# EAGLE schematic mainboard_r15_eurobot2014_r1 (EAGLE 6.3)

## Sheet 1 of 9
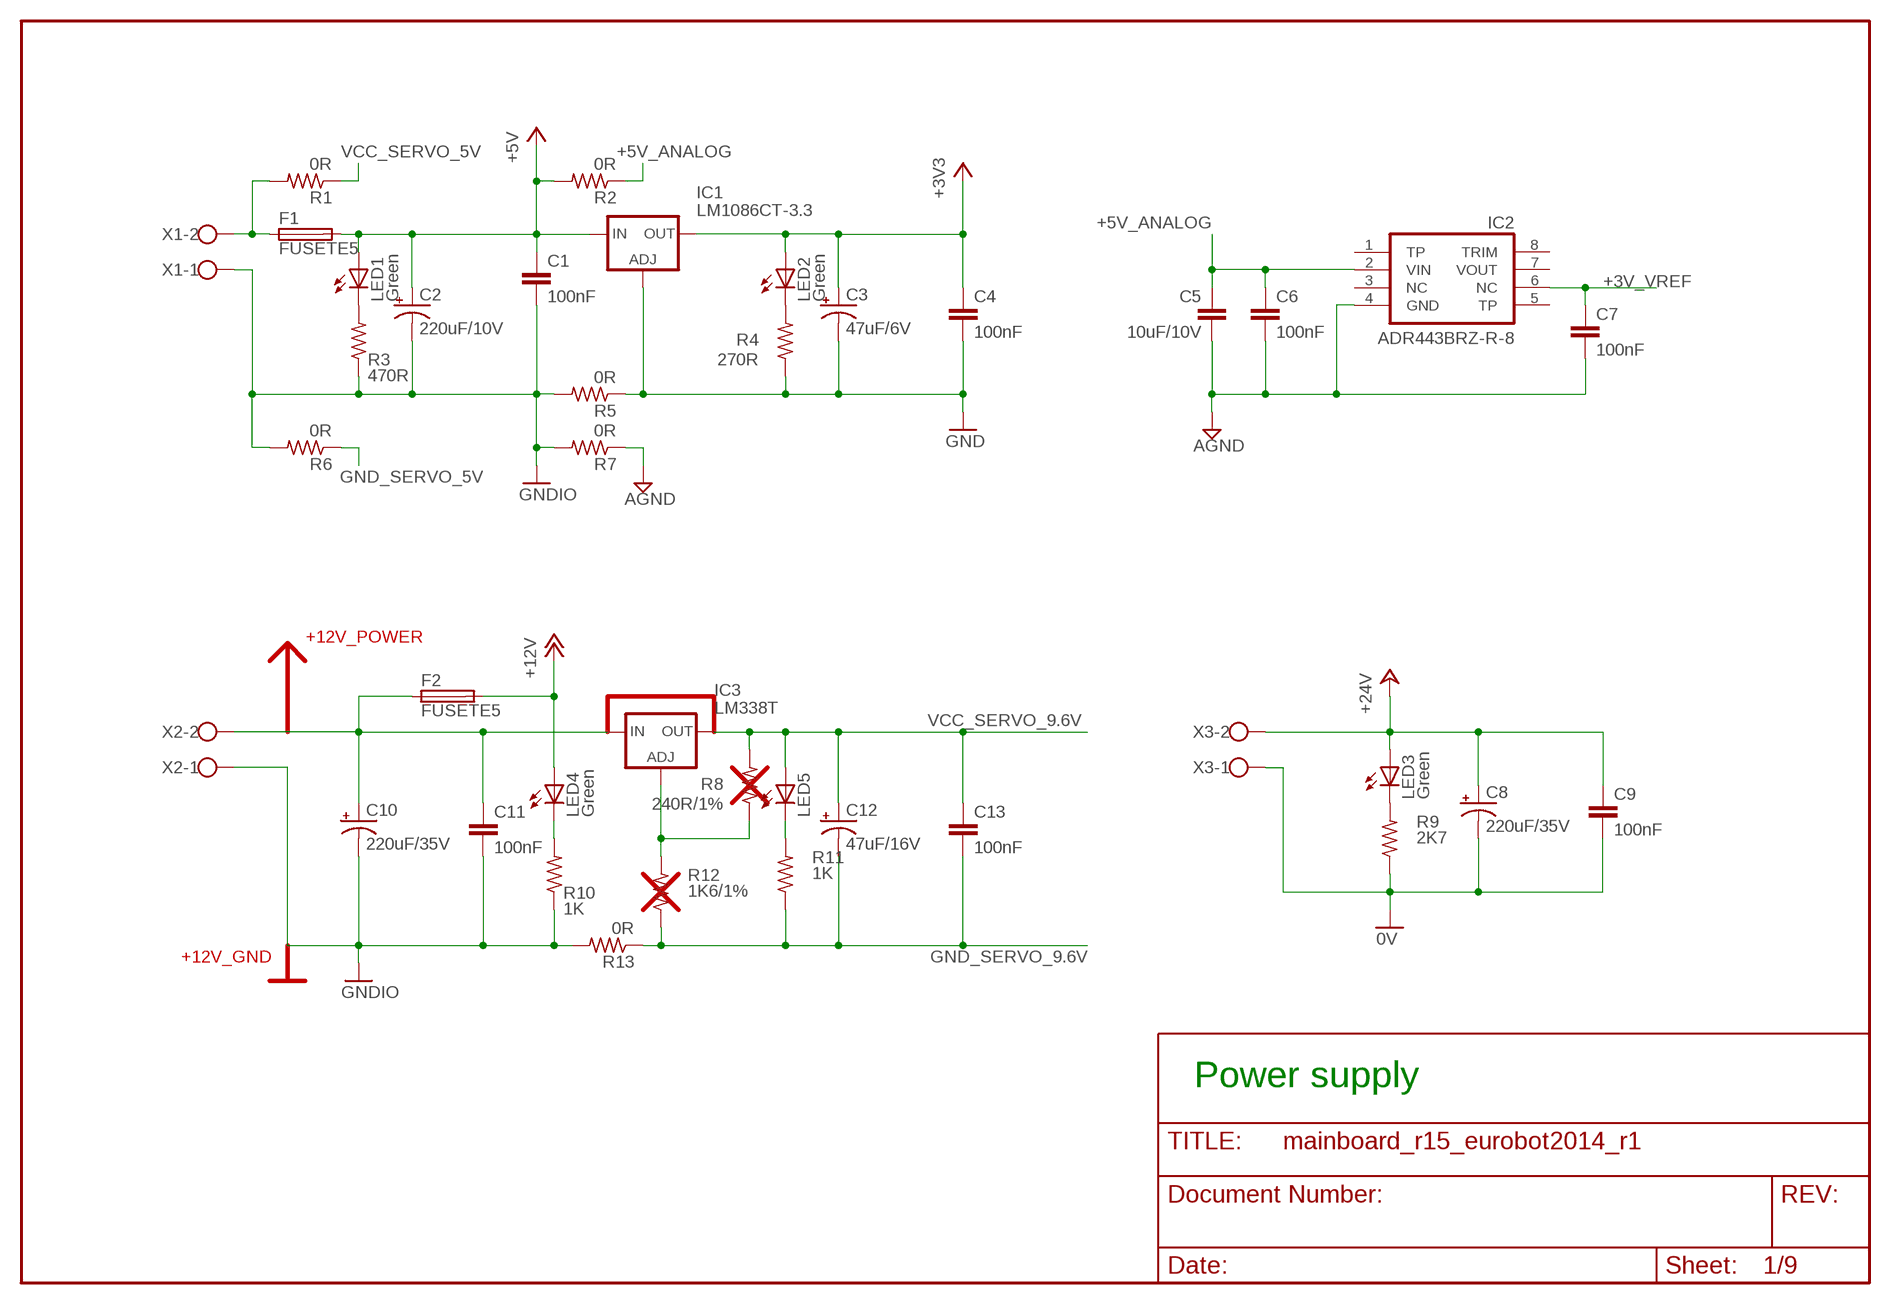
[diagram p0: schematic, sheet 1]

### Parts
C1  100nF  C-EUC0805  [C0805]
C2  220uF/10V  CPOL-USE2.5-7  [E2,5-7]
C3  47uF/6V  CPOL-USSMCD  [SMC_D]
C4  100nF  C-EUC0805  [C0805]
C5  10uF/10V  C-EUC1206  [C1206]
C6  100nF  C-EUC0805  [C0805]
C7  100nF  C-EUC0805  [C0805]
C8  220uF/35V  CPOL-USE5-10.5  [E5-10,5]
C9  100nF  C-EUC0805  [C0805]
C10  220uF/35V  CPOL-USE5-10.5  [E5-10,5]
C11  100nF  C-EUC0805  [C0805]
C12  47uF/16V  CPOL-USSMCD  [SMC_D]
C13  100nF  C-EUC0805  [C0805]
F1  FUSETE5  [TE5]
F2  FUSETE5  [TE5]
IC1  LM1086CT-3.3  LM317TS  [317TS]
IC2  ADR443BRZ-R-8  ADR443  [SOIC8]
IC3  LM338T  LM317TS  [317TS]
LED1  Green  LEDCHIP-LED0805  [CHIP-LED0805]
LED2  Green  LEDCHIP-LED0805  [CHIP-LED0805]
LED3  Green  LEDCHIP-LED0805  [CHIP-LED0805]
LED4  Green  LEDCHIP-LED0805  [CHIP-LED0805]
LED5  LEDCHIP-LED0805  [CHIP-LED0805]
R1  0R  R-US_R0805  [R0805]
R2  0R  R-US_R0805  [R0805]
R3  470R  R-US_R0805  [R0805]
R4  270R  R-US_R0805  [R0805]
R5  0R  R-US_R0805  [R0805]
R6  0R  R-US_R0805  [R0805]
R7  0R  R-US_R0805  [R0805]
R8  240R/1%  R-US_R0805  [R0805]
R9  2K7  R-US_R0805  [R0805]
R10  1K  R-US_R0805  [R0805]
R11  1K  R-US_R0805  [R0805]
R12  1K6/1%  R-US_R0805  [R0805]
R13  0R  R-US_R0805  [R0805]
X1  W237-02P  [W237-132]
X2  W237-02P  [W237-132]
X3  W237-02P  [W237-132]

### Nets
0V: C8.- C9.2 R9.1 X3.1 ; also sheet 7,8
+3V3: C3.+ C4.1 IC1.2(OUT) LED2.A ; also sheet 2,3,9
+3V_VREF: C7.1 IC2.6(NC) ; also sheet 2,3,4,8
+5V: C1.1 C2.+ F1.2 IC1.3(IN) LED1.A R2.2 ; also sheet 2,4,5,6,7
+5V_ANALOG: C5.1 C6.1 IC2.2(VIN) R2.1 ; also sheet 4,8
+12V: F2.2 LED4.A ; also sheet 4,5
+24V: C8.+ C9.1 LED3.A X3.2 ; also sheet 7,8
AGND: C5.2 C6.2 C7.2 IC2.4(GND) R7.1 ; also sheet 2,3,4,8
GND: C3.- C4.2 IC1.1(ADJ) R4.1 R5.1 ; also sheet 2,3,5,8,9
GND_SERVO_5V: R6.1 ; also sheet 6
GND_SERVO_9.6V: C12.- C13.2 R11.1 R12.1 R13.1 ; also sheet 6
GNDIO: C1.2 C2.- C10.- C11.2 R3.1 R5.2 R6.2 R7.2 R10.1 R13.2 X1.1 X2.1 ; also sheet 4,5,7
N$3: IC3.1(ADJ) R8.1 R12.2
N$12: LED5.C R11.2
N$43: C10.+ C11.1 F2.1 IC3.3(IN) X2.2
N$64: LED1.C R3.2
N$65: LED2.C R4.2
N$66: LED4.C R10.2
N$67: LED3.C R9.2
N$112: F1.1 R1.2 X1.2
VCC_SERVO_5V: R1.1 ; also sheet 6
VCC_SERVO_9.6V: C12.+ C13.1 IC3.2(OUT) LED5.A R8.2 ; also sheet 6
Unconnected: IC2.1(TP) IC2.3(NC) IC2.5(TP) IC2.7(VOUT) IC2.8(TRIM)

### Notes on the sheet
- +12V_POWER
- +12V_GND
- Power supply

## Sheet 2 of 9
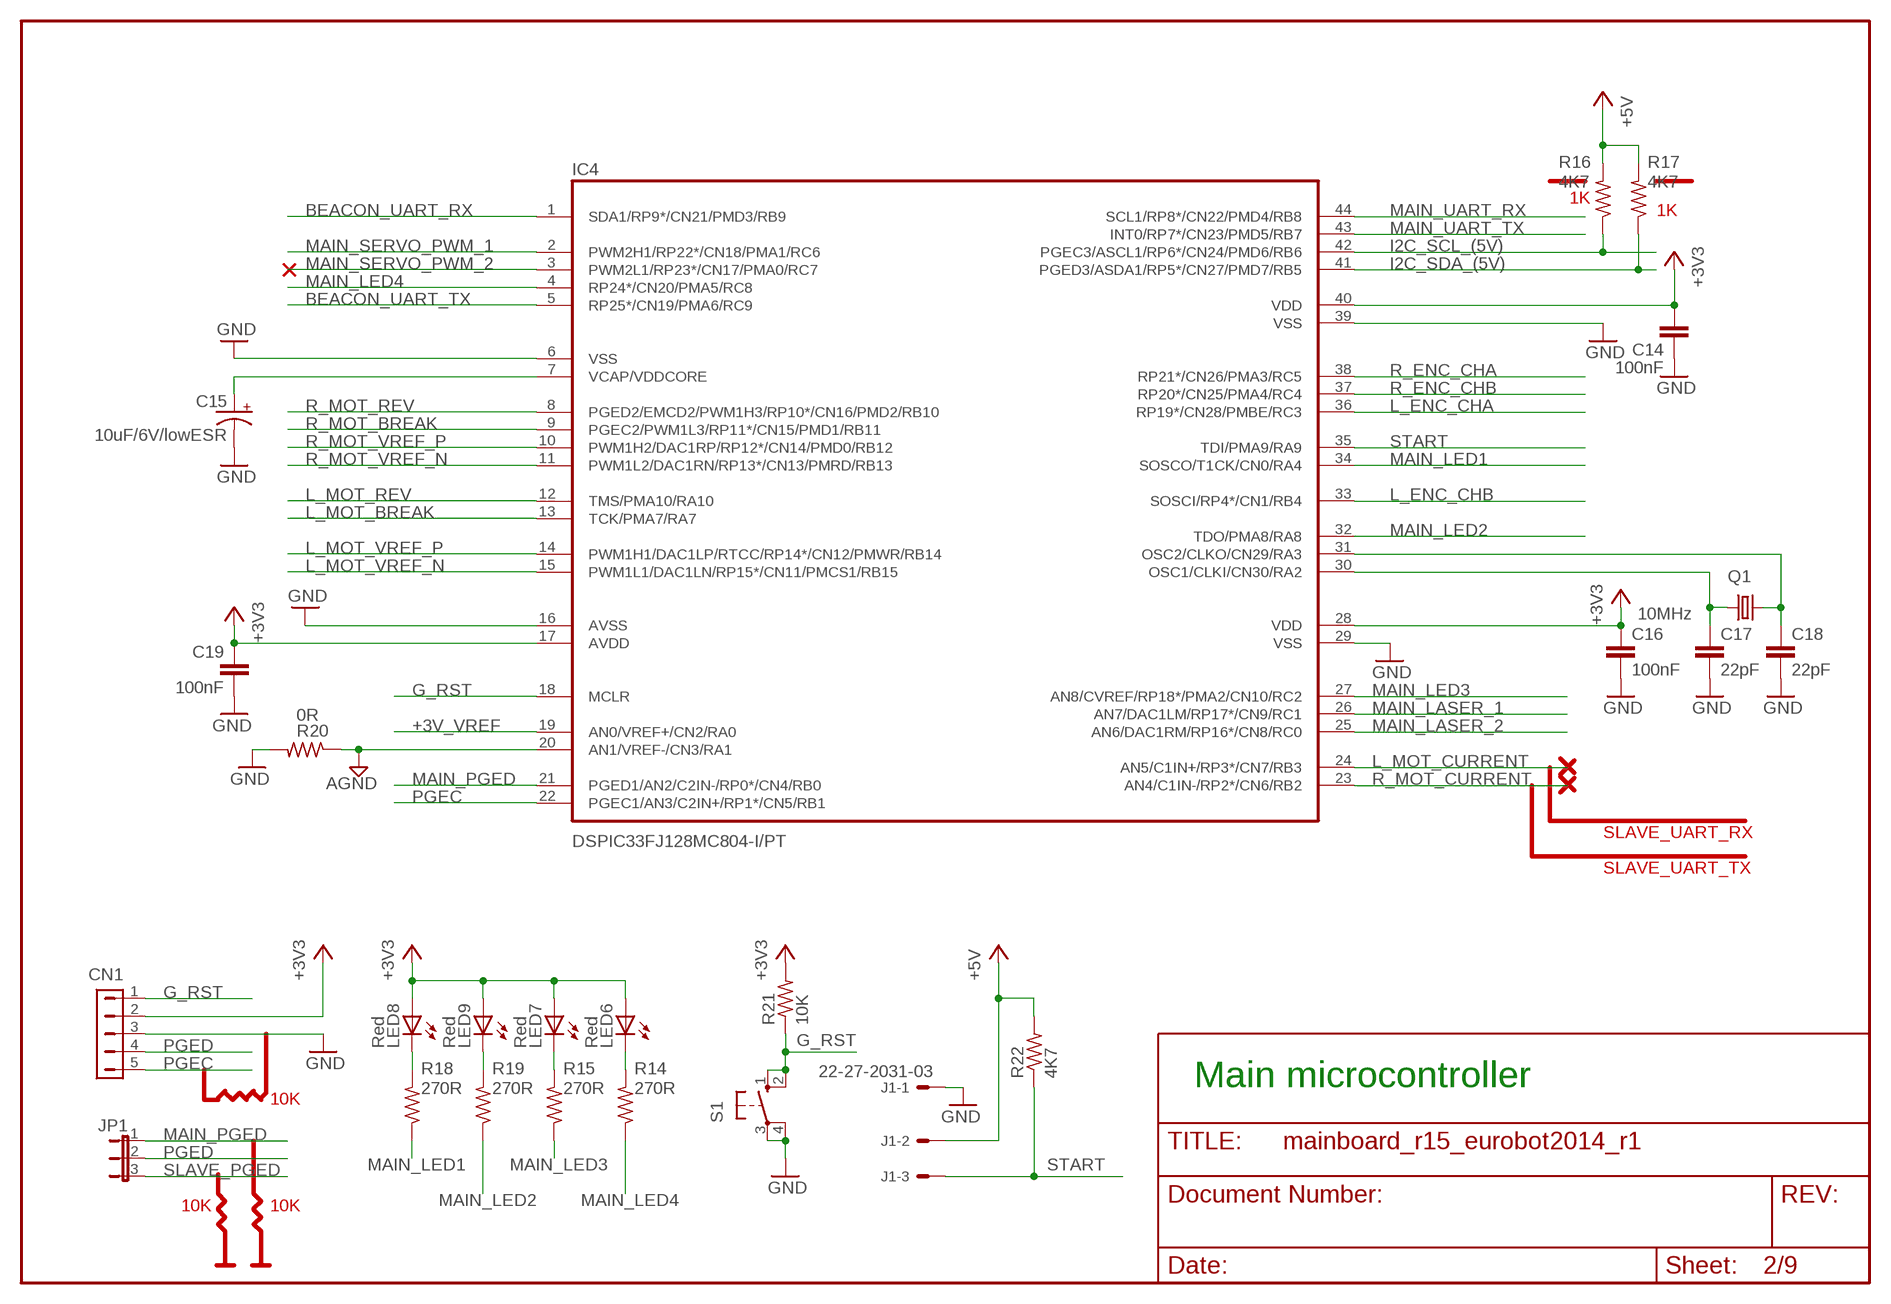
[diagram p1: schematic, sheet 2]

### Parts
C14  100nF  C-EUC0603  [C0603]
C15  10uF/6V/lowESR  CPOL-USSMCA  [SMC_A]
C16  100nF  C-EUC0603  [C0603]
C17  22pF  C-EUC0805  [C0805]
C18  22pF  C-EUC0805  [C0805]
C19  100nF  C-EUC0603  [C0603]
CN1  HDR-1X5-SIP-100  [SIP-100-5V]
IC4  DSPIC33FJ128MC804-I/PT  DSPIC33FJXXMC804SMD  [TQFP44]
J1  22-27-2031-03  [6410-03]
JP1  JP2E  [JP2]
LED6  Red  LEDCHIP-LED0805  [CHIP-LED0805]
LED7  Red  LEDCHIP-LED0805  [CHIP-LED0805]
LED8  Red  LEDCHIP-LED0805  [CHIP-LED0805]
LED9  Red  LEDCHIP-LED0805  [CHIP-LED0805]
Q1  10MHz  CRYSTALHC49UP  [HC49UP]
R14  270R  R-US_R0805  [R0805]
R15  270R  R-US_R0805  [R0805]
R16  4K7  R-US_R0805  [R0805]
R17  4K7  R-US_R0805  [R0805]
R18  270R  R-US_R0805  [R0805]
R19  270R  R-US_R0805  [R0805]
R20  0R  R-US_R0805  [R0805]
R21  10K  R-US_R0805  [R0805]
R22  4K7  R-US_R0805  [R0805]
S1  10-XX  [B3F-10XX]

### Nets
+3V3: C14.1 C16.1 C19.1 CN1.2 IC4.17(AVDD) IC4.28(VDD) IC4.40(VDD) LED6.A LED7.A LED8.A LED9.A R21.2 ; also sheet 1,3,9
+3V_VREF: IC4.19(AN0/VREF+/CN2/RA0) ; also sheet 1,3,4,8
+5V: J1.2 R16.2 R17.2 R22.2 ; also sheet 1,4,5,6,7
AGND: IC4.20(AN1/VREF-/CN3/RA1) R20.1 ; also sheet 1,3,4,8
BEACON_UART_RX: IC4.1(SDA1/RP9*/CN21/PMD3/RB9) ; also sheet 9
BEACON_UART_TX: IC4.5(RP25*/CN19/PMA6/RC9) ; also sheet 9
G_RST: CN1.1 IC4.18(MCLR) R21.1 S1.1(S) S1.2(S1) ; also sheet 3
GND: C14.2 C15.- C16.2 C17.2 C18.2 C19.2 CN1.3 IC4.6(VSS) IC4.16(AVSS) IC4.29(VSS) IC4.39(VSS) J1.1 R20.2 S1.3(P) S1.4(P1) ; also sheet 1,3,5,8,9
I2C_SCL_(5V): IC4.42(PGEC3/ASCL1/RP6*/CN24/PMD6/RB6) R16.1 ; also sheet 3,5
I2C_SDA_(5V): IC4.41(PGED3/ASDA1/RP5*/CN27/PMD7/RB5) R17.1 ; also sheet 3,5
L_ENC_CHA: IC4.36(RP19*/CN28/PMBE/RC3) ; also sheet 5
L_ENC_CHB: IC4.33(SOSCI/RP4*/CN1/RB4) ; also sheet 5
L_MOT_BREAK: IC4.13(TCK/PMA7/RA7) ; also sheet 8
L_MOT_CURRENT: IC4.24(AN5/C1IN+/RP3*/CN7/RB3) ; also sheet 8
L_MOT_REV: IC4.12(TMS/PMA10/RA10) ; also sheet 8
L_MOT_VREF_N: IC4.15(PWM1L1/DAC1LN/RP15*/CN11/PMCS1/RB15) ; also sheet 8
L_MOT_VREF_P: IC4.14(PWM1H1/DAC1LP/RTCC/RP14*/CN12/PMWR/RB14) ; also sheet 8
MAIN_LASER_1: IC4.26(AN7/DAC1LM/RP17*/CN9/RC1) ; also sheet 4
MAIN_LASER_2: IC4.25(AN6/DAC1RM/RP16*/CN8/RC0) ; also sheet 4
MAIN_LED1: IC4.34(SOSCO/T1CK/CN0/RA4) R18.1
MAIN_LED2: IC4.32(TDO/PMA8/RA8) R19.1
MAIN_LED3: IC4.27(AN8/CVREF/RP18*/PMA2/CN10/RC2) R15.1
MAIN_LED4: IC4.4(RP24*/CN20/PMA5/RC8) R14.1
MAIN_PGED: IC4.21(PGED1/AN2/C2IN-/RP0*/CN4/RB0) JP1.1
MAIN_SERVO_PWM_1: IC4.2(PWM2H1/RP22*/CN18/PMA1/RC6) ; also sheet 6
MAIN_SERVO_PWM_2: IC4.3(PWM2L1/RP23*/CN17/PMA0/RC7) ; also sheet 6
MAIN_UART_RX: IC4.44(SCL1/RP8*/CN22/PMD4/RB8) ; also sheet 9
MAIN_UART_TX: IC4.43(INT0/RP7*/CN23/PMD5/RB7) ; also sheet 9
N$8: LED8.C R18.2
N$10: LED9.C R19.2
N$11: LED7.C R15.2
N$13: LED6.C R14.2
N$47: C18.1 IC4.31(OSC2/CLKO/CN29/RA3) Q1.2
N$48: C17.1 IC4.30(OSC1/CLKI/CN30/RA2) Q1.1
N$49: C15.+ IC4.7(VCAP/VDDCORE)
PGEC: CN1.5 IC4.22(PGEC1/AN3/C2IN+/RP1*/CN5/RB1) ; also sheet 3
PGED: CN1.4 JP1.2
R_ENC_CHA: IC4.38(RP21*/CN26/PMA3/RC5) ; also sheet 5
R_ENC_CHB: IC4.37(RP20*/CN25/PMA4/RC4) ; also sheet 5
R_MOT_BREAK: IC4.9(PGEC2/PWM1L3/RP11*/CN15/PMD1/RB11) ; also sheet 8
R_MOT_CURRENT: IC4.23(AN4/C1IN-/RP2*/CN6/RB2) ; also sheet 8
R_MOT_REV: IC4.8(PGED2/EMCD2/PWM1H3/RP10*/CN16/PMD2/RB10) ; also sheet 8
R_MOT_VREF_N: IC4.11(PWM1L2/DAC1RN/RP13*/CN13/PMRD/RB13) ; also sheet 8
R_MOT_VREF_P: IC4.10(PWM1H2/DAC1RP/RP12*/CN14/PMD0/RB12) ; also sheet 8
SLAVE_PGED: JP1.3 ; also sheet 3
START: IC4.35(TDI/PMA9/RA9) J1.3 R22.1

### Notes on the sheet
- 1K
- 1K
- SLAVE_UART_RX
- SLAVE_UART_TX
- Main microcontroller
- 10K
- 10K | 10K

## Sheet 3 of 9
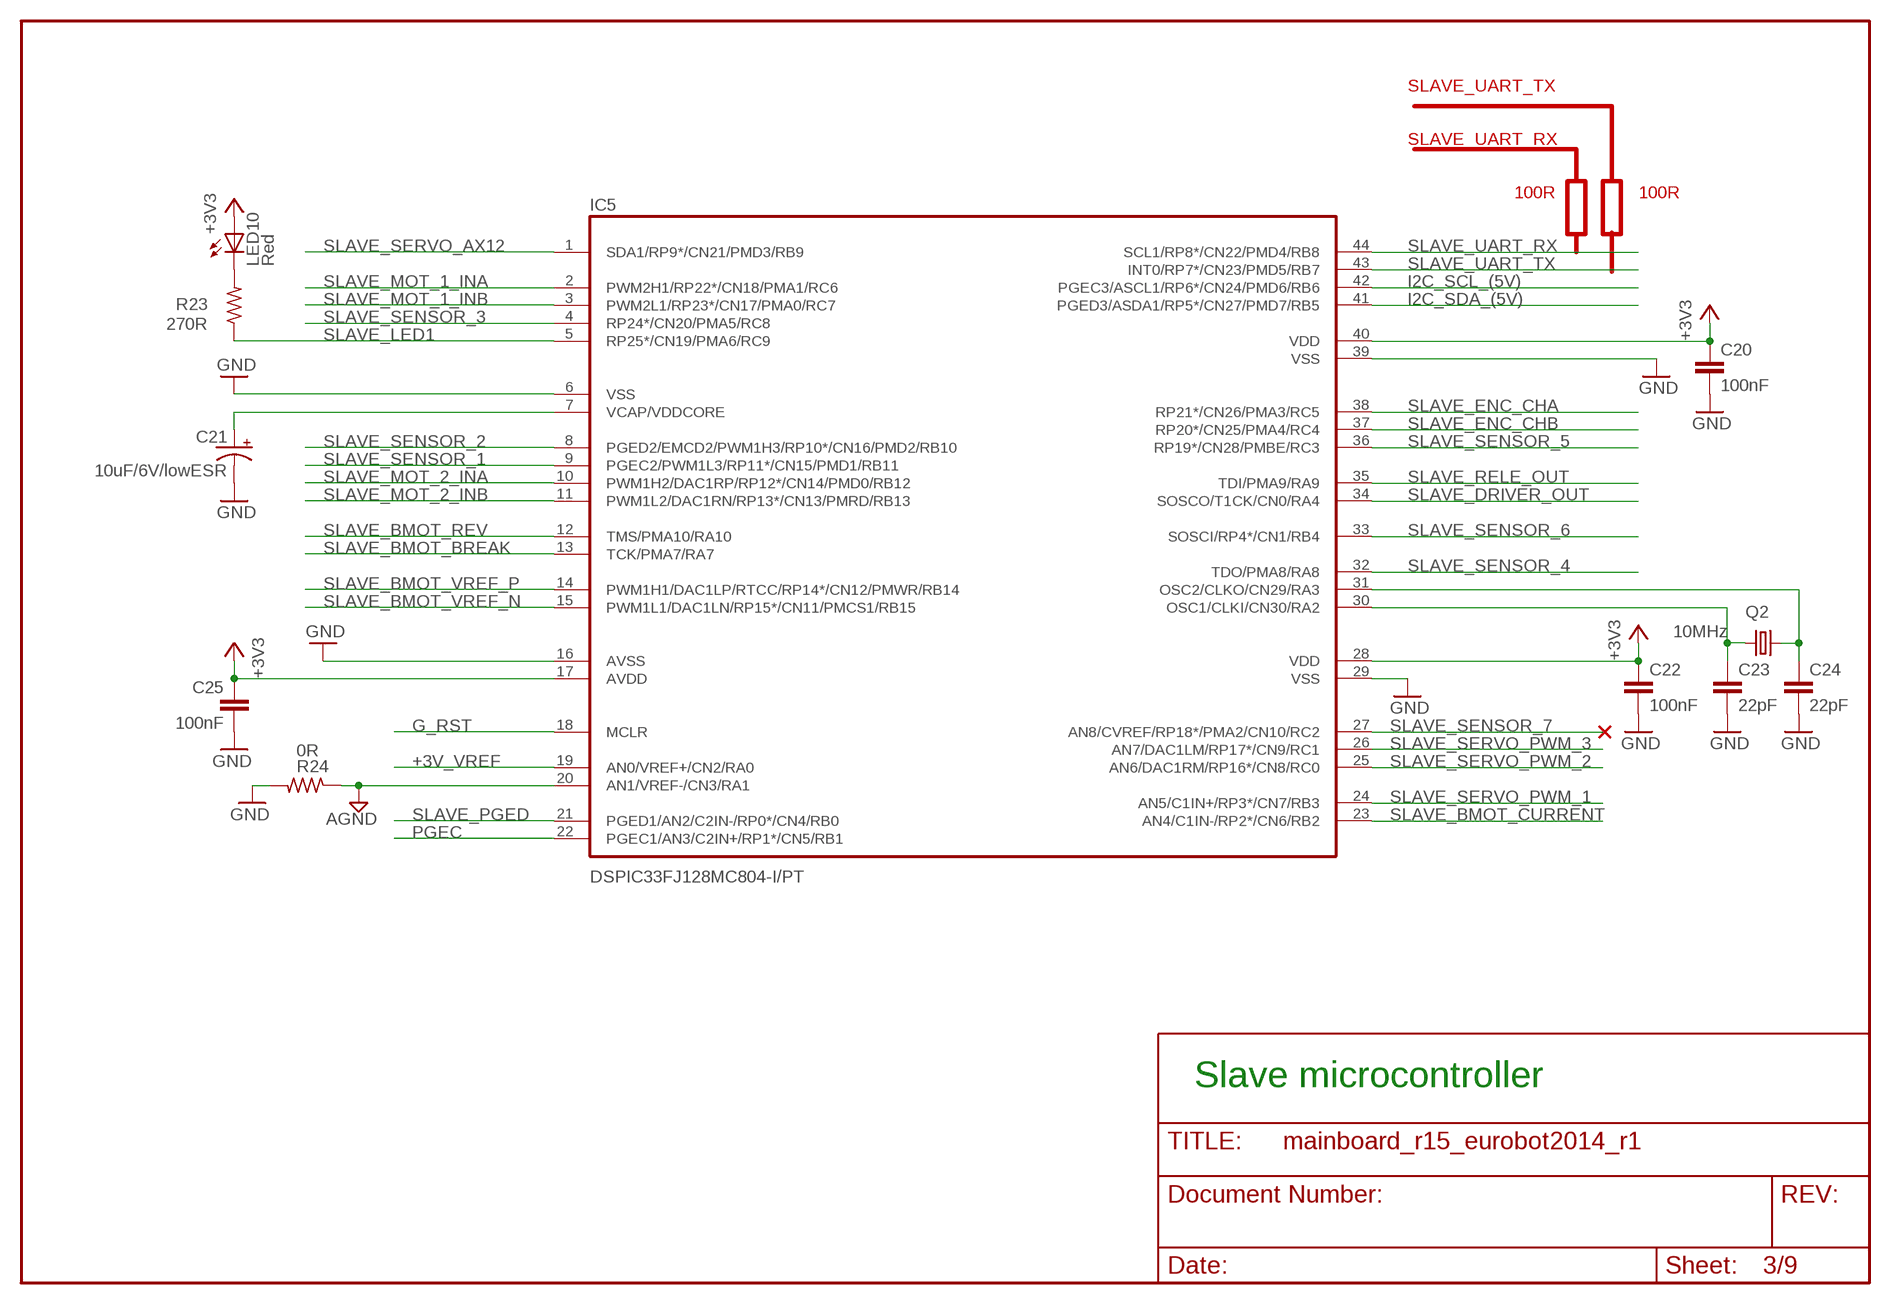
[diagram p2: schematic, sheet 3]

### Parts
C20  100nF  C-EUC0603  [C0603]
C21  10uF/6V/lowESR  CPOL-USSMCA  [SMC_A]
C22  100nF  C-EUC0603  [C0603]
C23  22pF  C-EUC0805  [C0805]
C24  22pF  C-EUC0805  [C0805]
C25  100nF  C-EUC0603  [C0603]
IC5  DSPIC33FJ128MC804-I/PT  DSPIC33FJXXMC804SMD  [TQFP44]
LED10  Red  LEDCHIP-LED0805  [CHIP-LED0805]
Q2  10MHz  CRYSTALHC49UP  [HC49UP]
R23  270R  R-US_R0805  [R0805]
R24  0R  R-US_R0805  [R0805]

### Nets
+3V3: C20.1 C22.1 C25.1 IC5.17(AVDD) IC5.28(VDD) IC5.40(VDD) LED10.A ; also sheet 1,2,9
+3V_VREF: IC5.19(AN0/VREF+/CN2/RA0) ; also sheet 1,2,4,8
AGND: IC5.20(AN1/VREF-/CN3/RA1) R24.1 ; also sheet 1,2,4,8
G_RST: IC5.18(MCLR) ; also sheet 2
GND: C20.2 C21.- C22.2 C23.2 C24.2 C25.2 IC5.6(VSS) IC5.16(AVSS) IC5.29(VSS) IC5.39(VSS) R24.2 ; also sheet 1,2,5,8,9
I2C_SCL_(5V): IC5.42(PGEC3/ASCL1/RP6*/CN24/PMD6/RB6) ; also sheet 2,5
I2C_SDA_(5V): IC5.41(PGED3/ASDA1/RP5*/CN27/PMD7/RB5) ; also sheet 2,5
N$1: LED10.C R23.2
N$50: C24.1 IC5.31(OSC2/CLKO/CN29/RA3) Q2.2
N$51: C23.1 IC5.30(OSC1/CLKI/CN30/RA2) Q2.1
N$52: C21.+ IC5.7(VCAP/VDDCORE)
PGEC: IC5.22(PGEC1/AN3/C2IN+/RP1*/CN5/RB1) ; also sheet 2
SLAVE_BMOT_BREAK: IC5.13(TCK/PMA7/RA7) ; also sheet 8
SLAVE_BMOT_CURRENT: IC5.23(AN4/C1IN-/RP2*/CN6/RB2) ; also sheet 8
SLAVE_BMOT_REV: IC5.12(TMS/PMA10/RA10) ; also sheet 8
SLAVE_BMOT_VREF_N: IC5.15(PWM1L1/DAC1LN/RP15*/CN11/PMCS1/RB15) ; also sheet 8
SLAVE_BMOT_VREF_P: IC5.14(PWM1H1/DAC1LP/RTCC/RP14*/CN12/PMWR/RB14) ; also sheet 8
SLAVE_DRIVER_OUT: IC5.34(SOSCO/T1CK/CN0/RA4) ; also sheet 7
SLAVE_ENC_CHA: IC5.38(RP21*/CN26/PMA3/RC5) ; also sheet 5
SLAVE_ENC_CHB: IC5.37(RP20*/CN25/PMA4/RC4) ; also sheet 5
SLAVE_LED1: IC5.5(RP25*/CN19/PMA6/RC9) R23.1
SLAVE_MOT_1_INA: IC5.2(PWM2H1/RP22*/CN18/PMA1/RC6) ; also sheet 7
SLAVE_MOT_1_INB: IC5.3(PWM2L1/RP23*/CN17/PMA0/RC7) ; also sheet 7
SLAVE_MOT_2_INA: IC5.10(PWM1H2/DAC1RP/RP12*/CN14/PMD0/RB12) ; also sheet 7
SLAVE_MOT_2_INB: IC5.11(PWM1L2/DAC1RN/RP13*/CN13/PMRD/RB13) ; also sheet 7
SLAVE_PGED: IC5.21(PGED1/AN2/C2IN-/RP0*/CN4/RB0) ; also sheet 2
SLAVE_RELE_OUT: IC5.35(TDI/PMA9/RA9) ; also sheet 7
SLAVE_SENSOR_1: IC5.9(PGEC2/PWM1L3/RP11*/CN15/PMD1/RB11) ; also sheet 5
SLAVE_SENSOR_2: IC5.8(PGED2/EMCD2/PWM1H3/RP10*/CN16/PMD2/RB10) ; also sheet 5
SLAVE_SENSOR_3: IC5.4(RP24*/CN20/PMA5/RC8) ; also sheet 5
SLAVE_SENSOR_4: IC5.32(TDO/PMA8/RA8) ; also sheet 5
SLAVE_SENSOR_5: IC5.36(RP19*/CN28/PMBE/RC3) ; also sheet 5
SLAVE_SENSOR_6: IC5.33(SOSCI/RP4*/CN1/RB4) ; also sheet 5
SLAVE_SENSOR_7: IC5.27(AN8/CVREF/RP18*/PMA2/CN10/RC2) ; also sheet 5
SLAVE_SERVO_AX12: IC5.1(SDA1/RP9*/CN21/PMD3/RB9) ; also sheet 6
SLAVE_SERVO_PWM_1: IC5.24(AN5/C1IN+/RP3*/CN7/RB3) ; also sheet 6
SLAVE_SERVO_PWM_2: IC5.25(AN6/DAC1RM/RP16*/CN8/RC0) ; also sheet 6
SLAVE_SERVO_PWM_3: IC5.26(AN7/DAC1LM/RP17*/CN9/RC1) ; also sheet 6
SLAVE_UART_RX: IC5.44(SCL1/RP8*/CN22/PMD4/RB8) ; also sheet 9
SLAVE_UART_TX: IC5.43(INT0/RP7*/CN23/PMD5/RB7) ; also sheet 9

### Notes on the sheet
- SLAVE_UART_TX
- SLAVE_UART_RX
- 100R | 100R
- Slave microcontroller

## Sheet 4 of 9
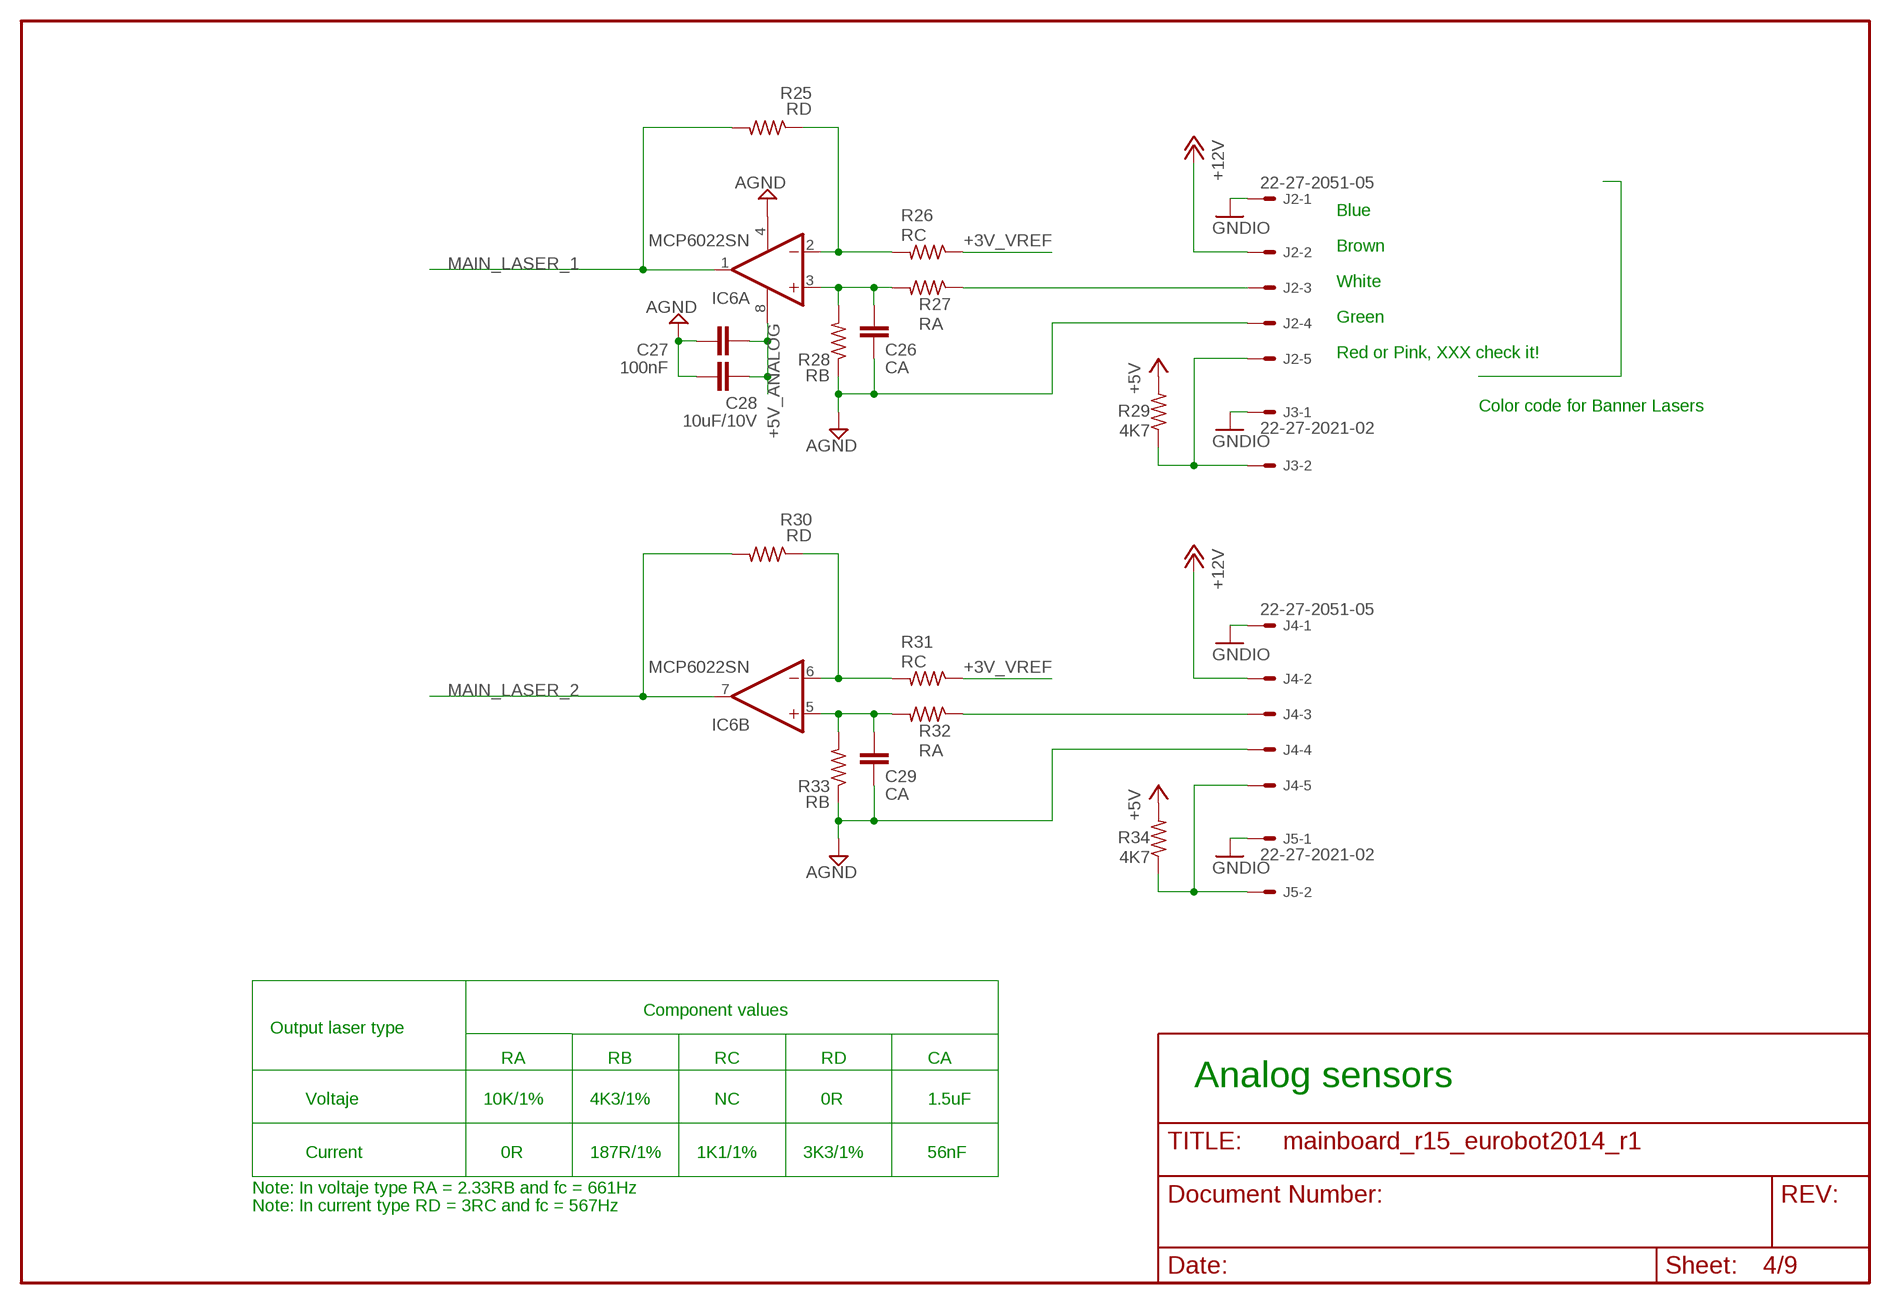
[diagram p3: schematic, sheet 4]

### Parts
C26  CA  C-EUC0805  [C0805]
C27  100nF  C-EUC0805  [C0805]
C28  10uF/10V  C-EUC1206  [C1206]
C29  CA  C-EUC0805  [C0805]
IC6  MCP6022SN  OPA2344U  [SO08]
J2  22-27-2051-05  [6410-05]
J3  22-27-2021-02  [6410-02]
J4  22-27-2051-05  [6410-05]
J5  22-27-2021-02  [6410-02]
R25  RD  R-US_R0805  [R0805]
R26  RC  R-US_R0805  [R0805]
R27  RA  R-US_R0805  [R0805]
R28  RB  R-US_R0805  [R0805]
R29  4K7  R-US_R0805  [R0805]
R30  RD  R-US_R0805  [R0805]
R31  RC  R-US_R0805  [R0805]
R32  RA  R-US_R0805  [R0805]
R33  RB  R-US_R0805  [R0805]
R34  4K7  R-US_R0805  [R0805]

### Nets
+3V_VREF: R26.1 R31.1 ; also sheet 1,2,3,8
+5V: R29.2 R34.2 ; also sheet 1,2,5,6,7
+5V_ANALOG: C27.1 C28.2 IC6.8(A:V+) ; also sheet 1,8
+12V: J2.2 J4.2 ; also sheet 1,5
AGND: C26.2 C27.2 C28.1 C29.2 IC6.4(A:V-) J2.4 J4.4 R28.1 R33.1 ; also sheet 1,2,3,8
GNDIO: J2.1 J3.1 J4.1 J5.1 ; also sheet 1,5,7
MAIN_LASER_1: IC6.1(A:OUT) R25.2 ; also sheet 2
MAIN_LASER_2: IC6.7(B:OUT) R30.2 ; also sheet 2
N$5: J2.3 R27.1
N$25: J4.5 J5.2 R34.1
N$28: J2.5 J3.2 R29.1
N$36: IC6.2(A:-IN) R25.1 R26.2
N$40: C26.1 IC6.3(A:+IN) R27.2 R28.2
N$94: IC6.6(B:-IN) R30.1 R31.2
N$95: C29.1 IC6.5(B:+IN) R32.2 R33.2
N$96: J4.3 R32.1

### Notes on the sheet
- Blue
- Brown
- White
- Green
- Red or Pink, XXX check it!
- Color code for Banner Lasers
- Component values
- Output laser type
- RA | RB | RC | RD | CA
- Analog sensors
- Voltaje | 10K/1% | 4K3/1% | NC | 0R | 1.5uF
- Current | 0R | 187R/1% | 1K1/1% | 3K3/1% | 56nF
- Note: In voltaje type RA = 2.33RB and fc = 661Hz
- Note: In current type RD = 3RC and fc = 567Hz

## Sheet 5 of 9
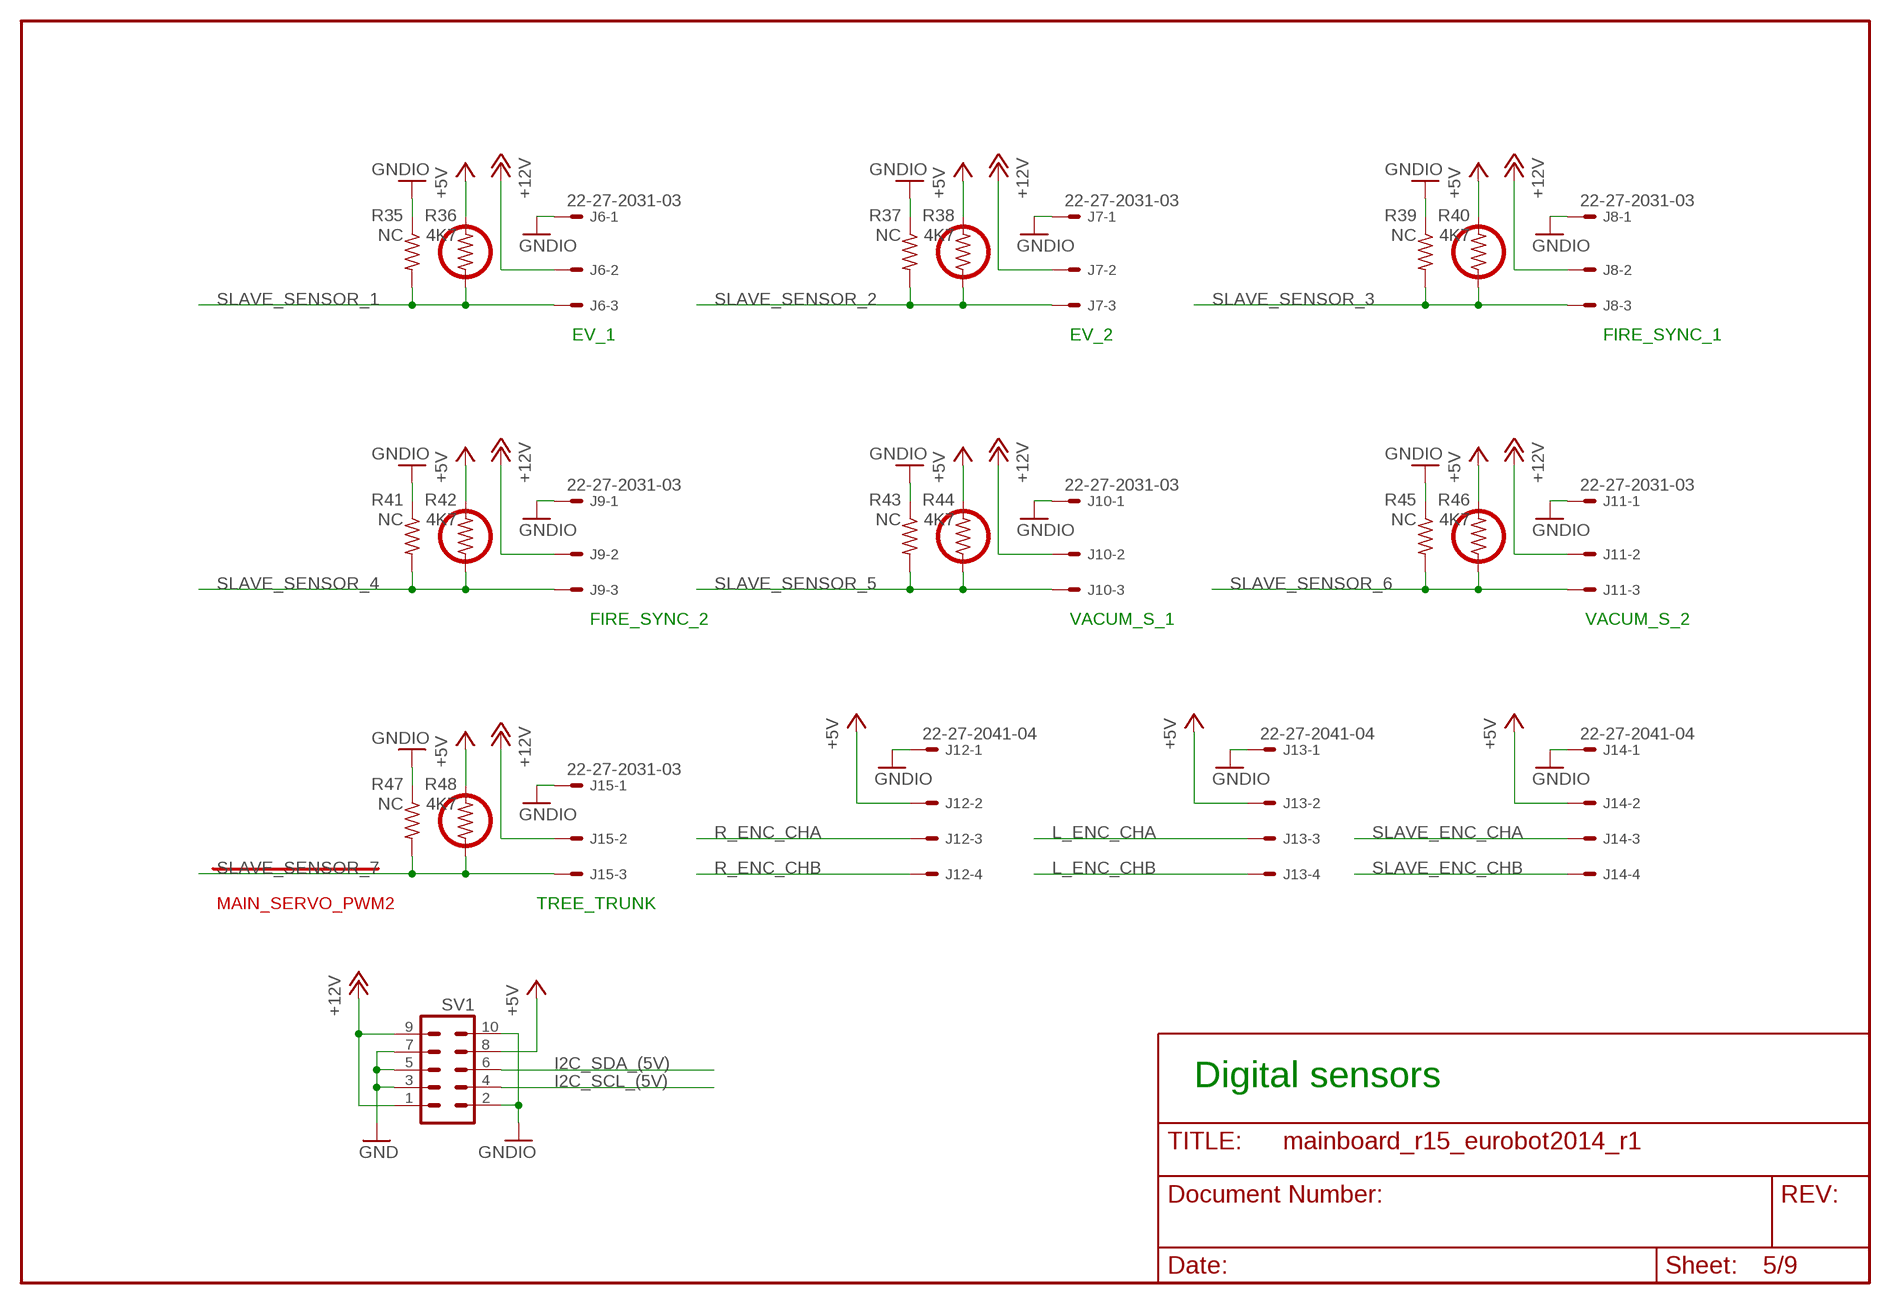
[diagram p4: schematic, sheet 5]

### Parts
J6  22-27-2031-03  [6410-03]
J7  22-27-2031-03  [6410-03]
J8  22-27-2031-03  [6410-03]
J9  22-27-2031-03  [6410-03]
J10  22-27-2031-03  [6410-03]
J11  22-27-2031-03  [6410-03]
J12  22-27-2041-04  [6410-04]
J13  22-27-2041-04  [6410-04]
J14  22-27-2041-04  [6410-04]
J15  22-27-2031-03  [6410-03]
R35  NC  R-US_R0805  [R0805]
R36  4K7  R-US_R0805  [R0805]
R37  NC  R-US_R0805  [R0805]
R38  4K7  R-US_R0805  [R0805]
R39  NC  R-US_R0805  [R0805]
R40  4K7  R-US_R0805  [R0805]
R41  NC  R-US_R0805  [R0805]
R42  4K7  R-US_R0805  [R0805]
R43  NC  R-US_R0805  [R0805]
R44  4K7  R-US_R0805  [R0805]
R45  NC  R-US_R0805  [R0805]
R46  4K7  R-US_R0805  [R0805]
R47  NC  R-US_R0805  [R0805]
R48  4K7  R-US_R0805  [R0805]
SV1  ML10  [ML10]

### Nets
+5V: J12.2 J13.2 J14.2 R36.2 R38.2 R40.2 R42.2 R44.2 R46.2 R48.2 SV1.8 ; also sheet 1,2,4,6,7
+12V: J6.2 J7.2 J8.2 J9.2 J10.2 J11.2 J15.2 SV1.1 SV1.9 ; also sheet 1,4
GND: SV1.3 SV1.5 SV1.7 ; also sheet 1,2,3,8,9
GNDIO: J6.1 J7.1 J8.1 J9.1 J10.1 J11.1 J12.1 J13.1 J14.1 J15.1 R35.1 R37.1 R39.1 R41.1 R43.1 R45.1 R47.1 SV1.2 SV1.10 ; also sheet 1,4,7
I2C_SCL_(5V): SV1.4 ; also sheet 2,3
I2C_SDA_(5V): SV1.6 ; also sheet 2,3
L_ENC_CHA: J13.3 ; also sheet 2
L_ENC_CHB: J13.4 ; also sheet 2
R_ENC_CHA: J12.3 ; also sheet 2
R_ENC_CHB: J12.4 ; also sheet 2
SLAVE_ENC_CHA: J14.3 ; also sheet 3
SLAVE_ENC_CHB: J14.4 ; also sheet 3
SLAVE_SENSOR_1: J6.3 R35.2 R36.1 ; also sheet 3
SLAVE_SENSOR_2: J7.3 R37.2 R38.1 ; also sheet 3
SLAVE_SENSOR_3: J8.3 R39.2 R40.1 ; also sheet 3
SLAVE_SENSOR_4: J9.3 R41.2 R42.1 ; also sheet 3
SLAVE_SENSOR_5: J10.3 R43.2 R44.1 ; also sheet 3
SLAVE_SENSOR_6: J11.3 R45.2 R46.1 ; also sheet 3
SLAVE_SENSOR_7: J15.3 R47.2 R48.1 ; also sheet 3

### Notes on the sheet
- EV_1 | EV_2 | FIRE_SYNC_1
- FIRE_SYNC_2 | VACUM_S_1 | VACUM_S_2
- MAIN_SERVO_PWM2 | TREE_TRUNK
- Digital sensors

## Sheet 6 of 9
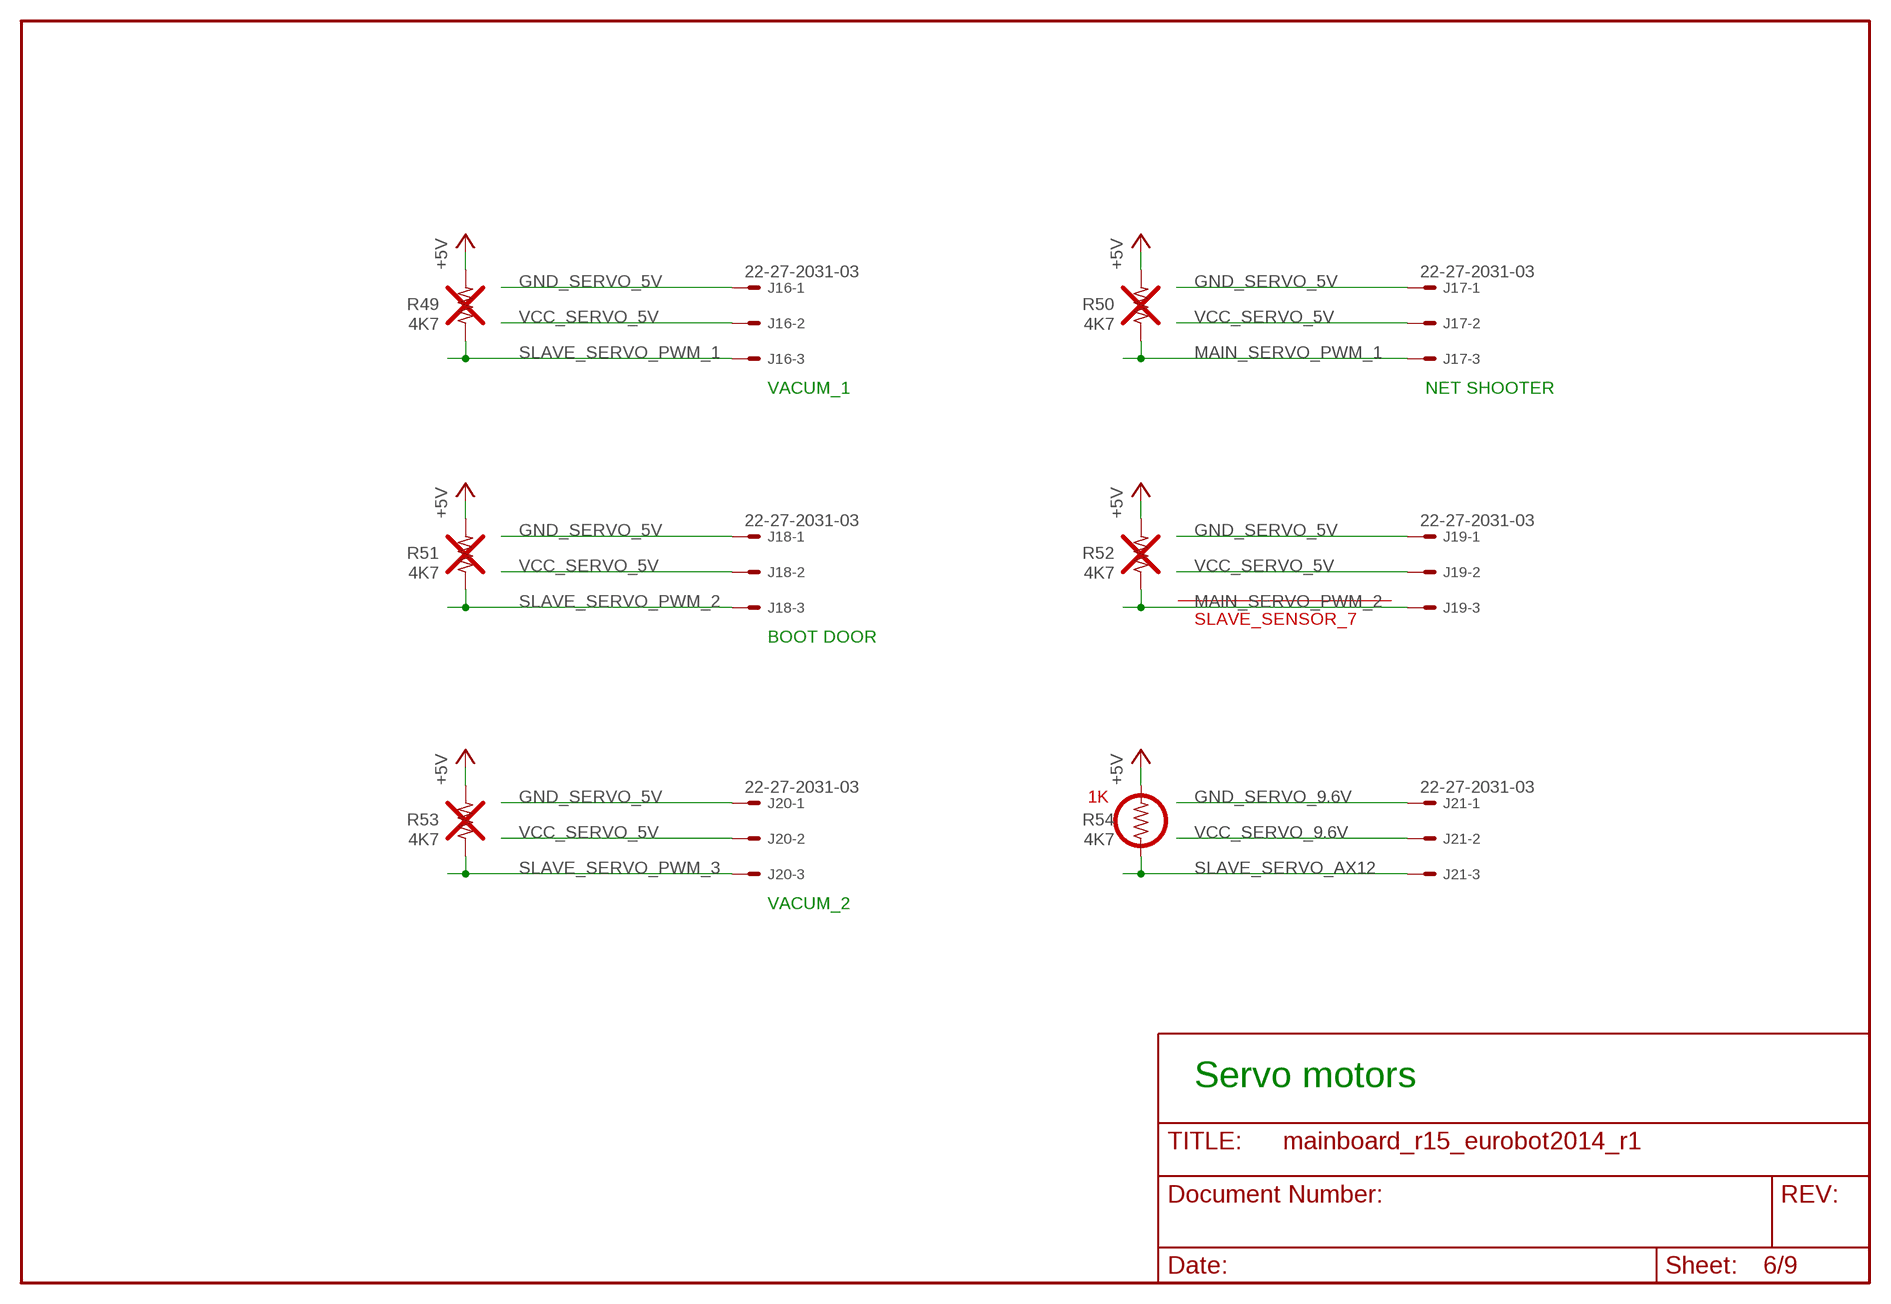
[diagram p5: schematic, sheet 6]

### Parts
J16  22-27-2031-03  [6410-03]
J17  22-27-2031-03  [6410-03]
J18  22-27-2031-03  [6410-03]
J19  22-27-2031-03  [6410-03]
J20  22-27-2031-03  [6410-03]
J21  22-27-2031-03  [6410-03]
R49  4K7  R-US_R0805  [R0805]
R50  4K7  R-US_R0805  [R0805]
R51  4K7  R-US_R0805  [R0805]
R52  4K7  R-US_R0805  [R0805]
R53  4K7  R-US_R0805  [R0805]
R54  4K7  R-US_R0805  [R0805]

### Nets
+5V: R49.2 R50.2 R51.2 R52.2 R53.2 R54.2 ; also sheet 1,2,4,5,7
GND_SERVO_5V: J16.1 J17.1 J18.1 J19.1 J20.1 ; also sheet 1
GND_SERVO_9.6V: J21.1 ; also sheet 1
MAIN_SERVO_PWM_1: J17.3 R50.1 ; also sheet 2
MAIN_SERVO_PWM_2: J19.3 R52.1 ; also sheet 2
SLAVE_SERVO_AX12: J21.3 R54.1 ; also sheet 3
SLAVE_SERVO_PWM_1: J16.3 R49.1 ; also sheet 3
SLAVE_SERVO_PWM_2: J18.3 R51.1 ; also sheet 3
SLAVE_SERVO_PWM_3: J20.3 R53.1 ; also sheet 3
VCC_SERVO_5V: J16.2 J17.2 J18.2 J19.2 J20.2 ; also sheet 1
VCC_SERVO_9.6V: J21.2 ; also sheet 1

### Notes on the sheet
- VACUM_1 | NET SHOOTER
- SLAVE_SENSOR_7
- BOOT DOOR
- 1K
- VACUM_2
- Servo motors

## Sheet 7 of 9
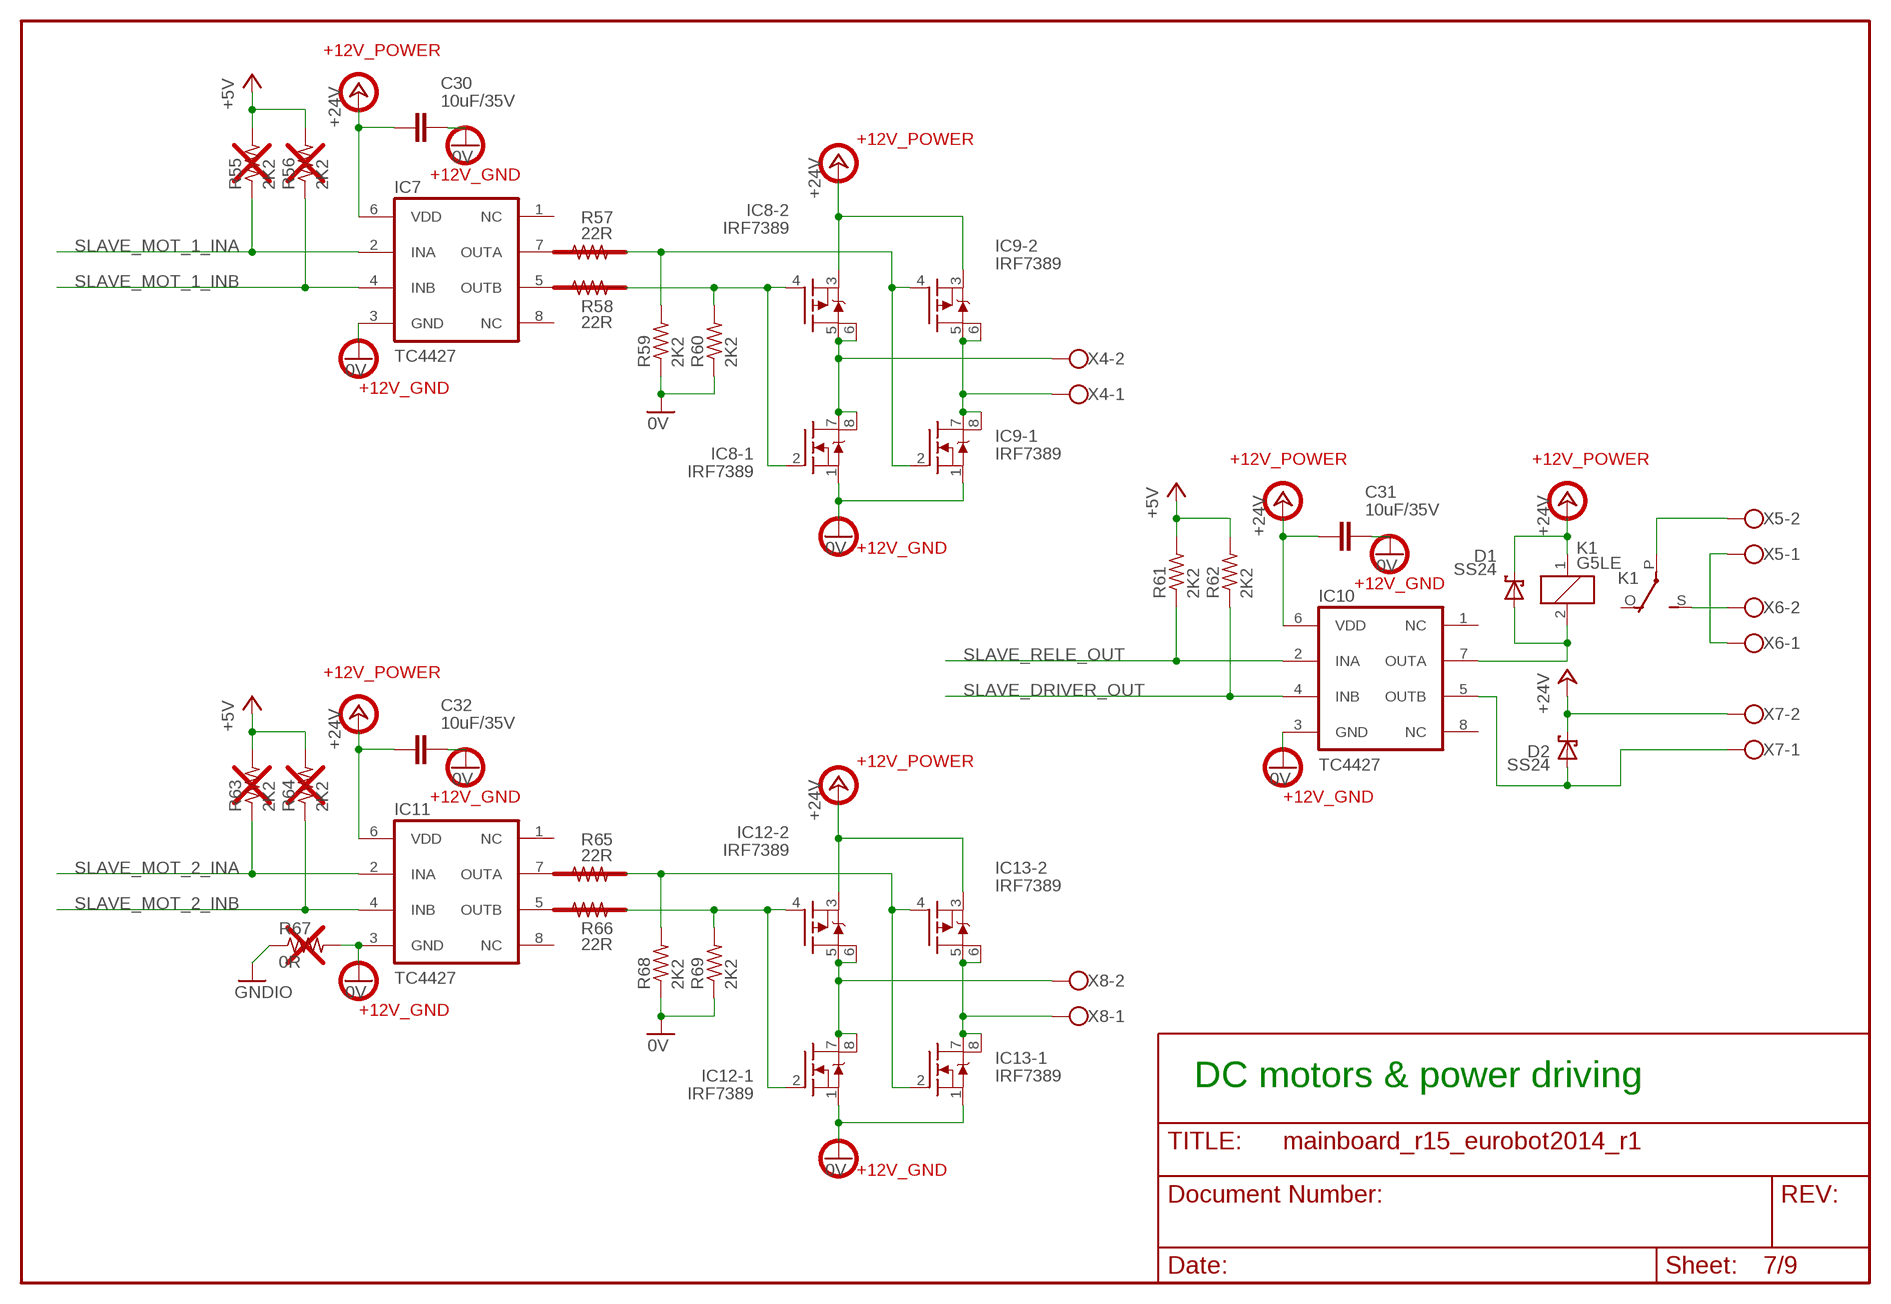
[diagram p6: schematic, sheet 7]

### Parts
C30  10uF/35V  C-EUC1206  [C1206]
C31  10uF/35V  C-EUC1206  [C1206]
C32  10uF/35V  C-EUC1206  [C1206]
D1  SS24  SCHOTTKY_SMB  [DIOM5436X265N]
D2  SS24  SCHOTTKY_SMB  [DIOM5436X265N]
IC7  TC4427  TC4427OA  [SO08]
IC8  IRF7389  [SO08]
IC9  IRF7389  [SO08]
IC10  TC4427  TC4427OA  [SO08]
IC11  TC4427  TC4427OA  [SO08]
IC12  IRF7389  [SO08]
IC13  IRF7389  [SO08]
K1  G5LE  [G5LE]
R55  2K2  R-US_R0805  [R0805]
R56  2K2  R-US_R0805  [R0805]
R57  22R  R-US_R0805  [R0805]
R58  22R  R-US_R0805  [R0805]
R59  2K2  R-US_R0805  [R0805]
R60  2K2  R-US_R0805  [R0805]
R61  2K2  R-US_R0805  [R0805]
R62  2K2  R-US_R0805  [R0805]
R63  2K2  R-US_R0805  [R0805]
R64  2K2  R-US_R0805  [R0805]
R65  22R  R-US_R0805  [R0805]
R66  22R  R-US_R0805  [R0805]
R67  0R  R-US_R0805  [R0805]
R68  2K2  R-US_R0805  [R0805]
R69  2K2  R-US_R0805  [R0805]
X4  W237-02P  [W237-132]
X5  W237-02P  [W237-132]
X6  W237-02P  [W237-132]
X7  W237-02P  [W237-132]
X8  W237-02P  [W237-132]

### Nets
0V: C30.1 C31.1 C32.1 IC7.3(GND) IC8.1(-1:S) IC9.1(-1:S) IC10.3(GND) IC11.3(GND) IC12.1(-1:S) IC13.1(-1:S) R59.1 R60.1 R67.2 R68.1 R69.1 ; also sheet 1,8
+5V: R55.2 R56.2 R61.2 R62.2 R63.2 R64.2 ; also sheet 1,2,4,5,6
+24V: C30.2 C31.2 C32.2 D1.K D2.K IC7.6(VDD) IC8.3(-2:S) IC9.3(-2:S) IC10.6(VDD) IC11.6(VDD) IC12.3(-2:S) IC13.3(-2:S) K1.1 X7.2 ; also sheet 1,8
GNDIO: R67.1 ; also sheet 1,4,5
N$2: IC8.5(-2:D) IC8.6(-2:D) IC8.7(-1:D) IC8.8(-1:D) X4.2
N$4: IC9.5(-2:D) IC9.6(-2:D) IC9.7(-1:D) IC9.8(-1:D) X4.1
N$6: IC8.2(-1:G) IC8.4(-2:G) R58.2 R60.2
N$7: IC9.2(-1:G) IC9.4(-2:G) R57.2 R59.2
N$14: IC7.7(OUTA) R57.1
N$15: IC7.5(OUTB) R58.1
N$17: IC12.5(-2:D) IC12.6(-2:D) IC12.7(-1:D) IC12.8(-1:D) X8.2
N$18: IC13.5(-2:D) IC13.6(-2:D) IC13.7(-1:D) IC13.8(-1:D) X8.1
N$19: IC12.2(-1:G) IC12.4(-2:G) R66.2 R69.2
N$20: IC13.2(-1:G) IC13.4(-2:G) R65.2 R68.2
N$21: IC11.7(OUTA) R65.1
N$22: IC11.5(OUTB) R66.1
N$23: D1.A IC10.7(OUTA) K1.2
N$24: X5.1 X6.1
N$26: K1.P(2:P) X5.2
N$35: K1.S(2:S) X6.2
N$38: D2.A IC10.5(OUTB) X7.1
SLAVE_DRIVER_OUT: IC10.4(INB) R62.1 ; also sheet 3
SLAVE_MOT_1_INA: IC7.2(INA) R55.1 ; also sheet 3
SLAVE_MOT_1_INB: IC7.4(INB) R56.1 ; also sheet 3
SLAVE_MOT_2_INA: IC11.2(INA) R63.1 ; also sheet 3
SLAVE_MOT_2_INB: IC11.4(INB) R64.1 ; also sheet 3
SLAVE_RELE_OUT: IC10.2(INA) R61.1 ; also sheet 3
Unconnected: IC7.1(NC) IC7.8(NC) IC10.1(NC) IC10.8(NC) IC11.1(NC) IC11.8(NC) K1.O(2:O)

### Notes on the sheet
- +12V_POWER
- +12V_POWER
- +12V_GND
- +12V_GND
- +12V_POWER | +12V_POWER
- +12V_GND
- +12V_GND
- +12V_POWER
- +12V_POWER
- +12V_GND | +12V_GND
- +12V_GND
- DC motors & power driving
- +12V_GND

## Sheet 8 of 9
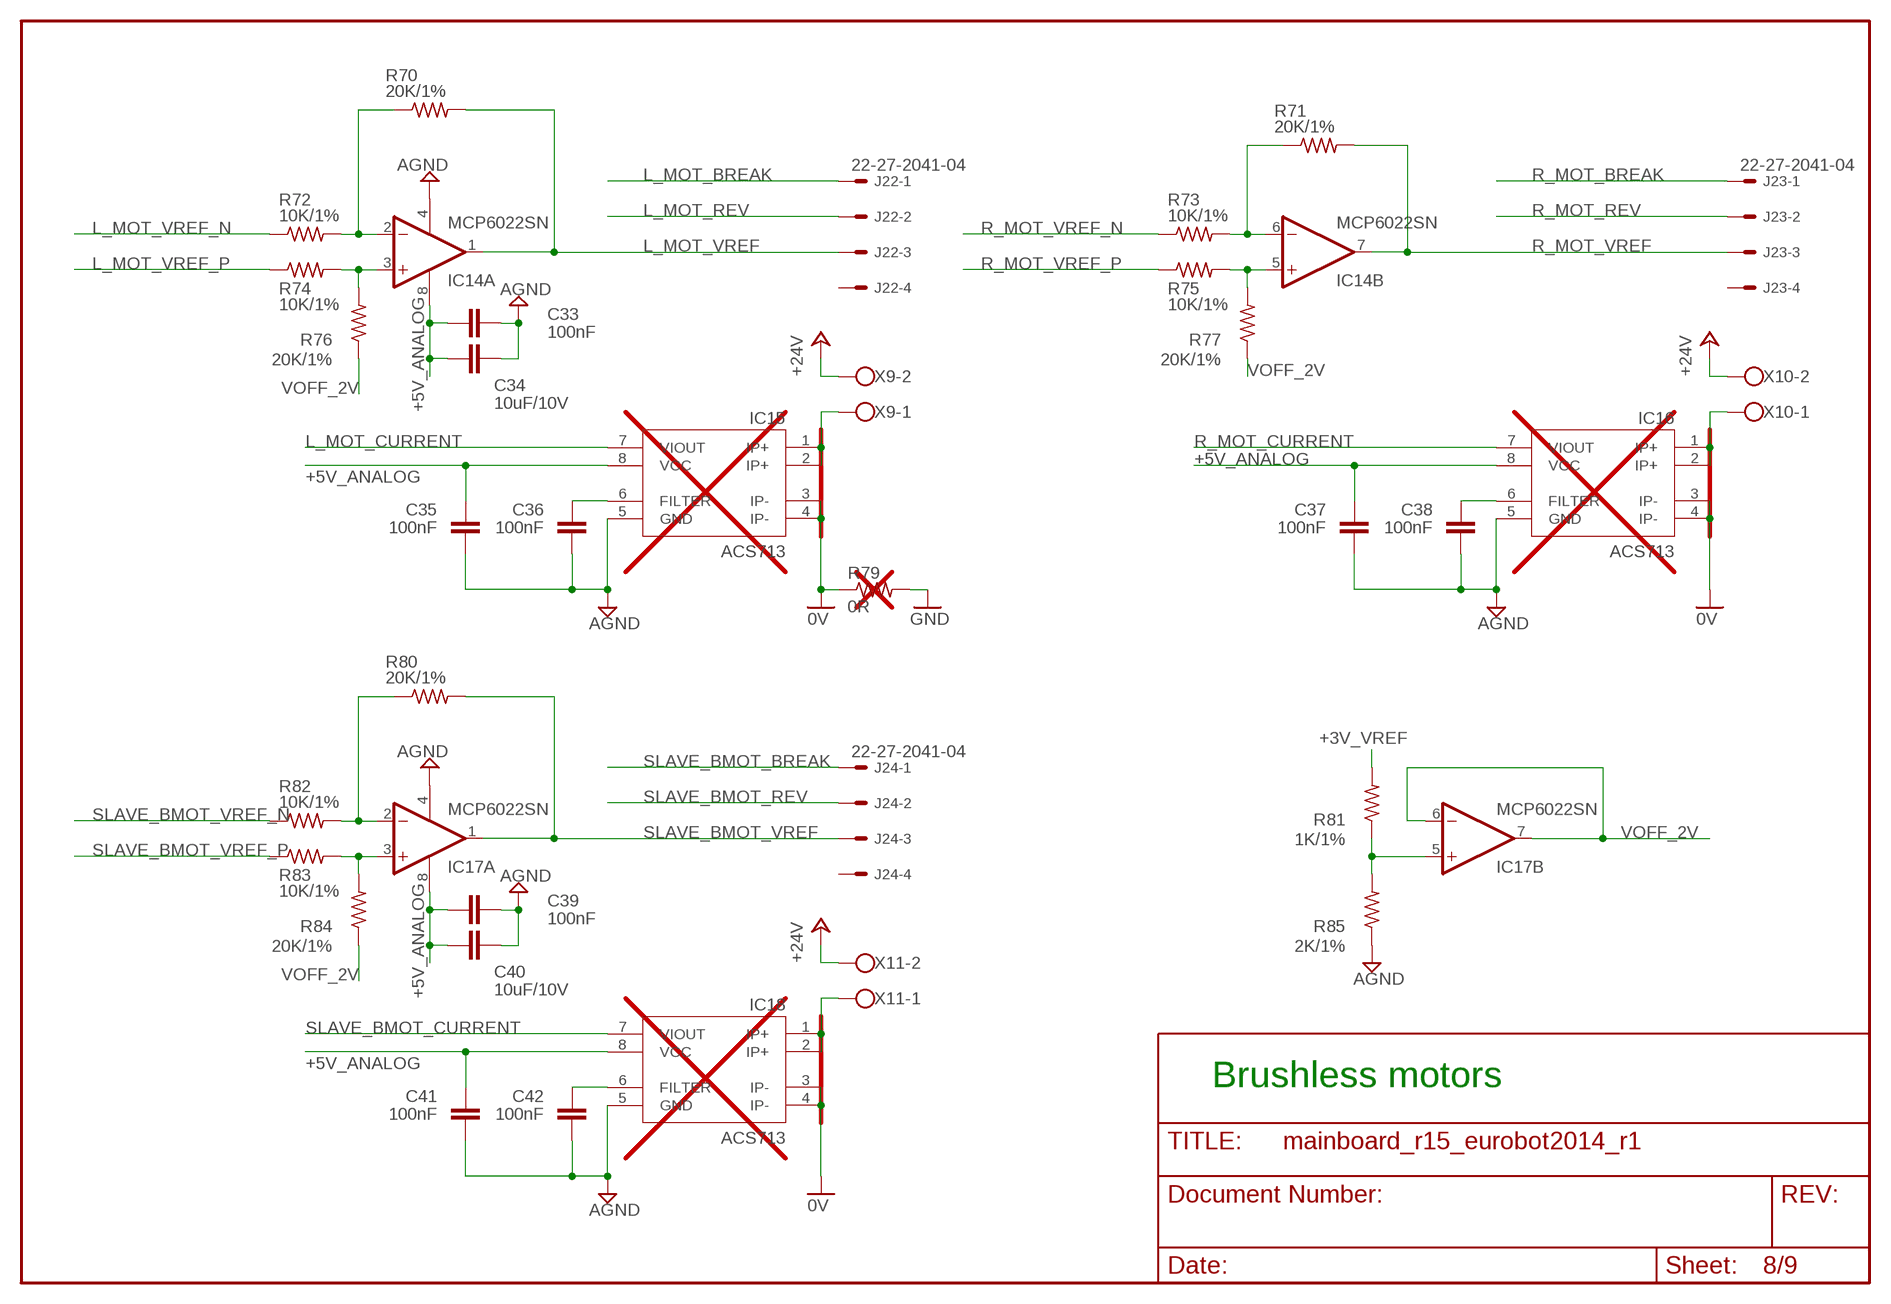
[diagram p7: schematic, sheet 8]

### Parts
C33  100nF  C-EUC0805  [C0805]
C34  10uF/10V  C-EUC1206  [C1206]
C35  100nF  C-EUC0805  [C0805]
C36  100nF  C-EUC0805  [C0805]
C37  100nF  C-EUC0805  [C0805]
C38  100nF  C-EUC0805  [C0805]
C39  100nF  C-EUC0805  [C0805]
C40  10uF/10V  C-EUC1206  [C1206]
C41  100nF  C-EUC0805  [C0805]
C42  100nF  C-EUC0805  [C0805]
IC14  MCP6022SN  OPA2344U  [SO08]
IC15  ACS713  ADS713  [SO08]
IC16  ACS713  ADS713  [SO08]
IC17  MCP6022SN  OPA2344U  [SO08]
IC18  ACS713  ADS713  [SO08]
J22  22-27-2041-04  [6410-04]
J23  22-27-2041-04  [6410-04]
J24  22-27-2041-04  [6410-04]
R70  20K/1%  R-US_R0805  [R0805]
R71  20K/1%  R-US_R0805  [R0805]
R72  10K/1%  R-US_R0805  [R0805]
R73  10K/1%  R-US_R0805  [R0805]
R74  10K/1%  R-US_R0805  [R0805]
R75  10K/1%  R-US_R0805  [R0805]
R76  20K/1%  R-US_R0805  [R0805]
R77  20K/1%  R-US_R0805  [R0805]
R79  0R  R-US_R0805  [R0805]
R80  20K/1%  R-US_R0805  [R0805]
R81  1K/1%  R-US_R0805  [R0805]
R82  10K/1%  R-US_R0805  [R0805]
R83  10K/1%  R-US_R0805  [R0805]
R84  20K/1%  R-US_R0805  [R0805]
R85  2K/1%  R-US_R0805  [R0805]
X9  W237-02P  [W237-132]
X10  W237-02P  [W237-132]
X11  W237-02P  [W237-132]

### Nets
0V: IC15.3(IP-) IC15.4(IP-) IC16.3(IP-) IC16.4(IP-) IC18.3(IP-) IC18.4(IP-) R79.1 ; also sheet 1,7
+3V_VREF: R81.2 ; also sheet 1,2,3,4
+5V_ANALOG: C33.1 C34.2 C35.2 C37.2 C39.1 C40.2 C41.2 IC14.8(A:V+) IC15.8(VCC) IC16.8(VCC) IC17.8(A:V+) IC18.8(VCC) ; also sheet 1,4
+24V: X9.2 X10.2 X11.2 ; also sheet 1,7
AGND: C33.2 C34.1 C35.1 C36.1 C37.1 C38.1 C39.2 C40.1 C41.1 C42.1 IC14.4(A:V-) IC15.5(GND) IC16.5(GND) IC17.4(A:V-) IC18.5(GND) R85.1 ; also sheet 1,2,3,4
GND: R79.2 ; also sheet 1,2,3,5,9
L_MOT_BREAK: J22.1 ; also sheet 2
L_MOT_CURRENT: IC15.7(VIOUT) ; also sheet 2
L_MOT_REV: J22.2 ; also sheet 2
L_MOT_VREF: IC14.1(A:OUT) J22.3 R70.2
L_MOT_VREF_N: R72.1 ; also sheet 2
L_MOT_VREF_P: R74.1 ; also sheet 2
N$61: IC14.2(A:-IN) R70.1 R72.2
N$70: IC14.3(A:+IN) R74.2 R76.2
N$71: IC14.6(B:-IN) R71.1 R73.2
N$72: IC15.1(IP+) IC15.2(IP+) X9.1
N$73: C36.2 IC15.6(FILTER)
N$74: IC14.5(B:+IN) R75.2 R77.2
N$75: IC17.5(B:+IN) R81.1 R85.2
N$76: IC16.1(IP+) IC16.2(IP+) X10.1
N$77: C38.2 IC16.6(FILTER)
N$78: IC18.1(IP+) IC18.2(IP+) X11.1
N$79: C42.2 IC18.6(FILTER)
N$83: IC17.2(A:-IN) R80.1 R82.2
N$84: IC17.3(A:+IN) R83.2 R84.2
R_MOT_BREAK: J23.1 ; also sheet 2
R_MOT_CURRENT: IC16.7(VIOUT) ; also sheet 2
R_MOT_REV: J23.2 ; also sheet 2
R_MOT_VREF: IC14.7(B:OUT) J23.3 R71.2
R_MOT_VREF_N: R73.1 ; also sheet 2
R_MOT_VREF_P: R75.1 ; also sheet 2
SLAVE_BMOT_BREAK: J24.1 ; also sheet 3
SLAVE_BMOT_CURRENT: IC18.7(VIOUT) ; also sheet 3
SLAVE_BMOT_REV: J24.2 ; also sheet 3
SLAVE_BMOT_VREF: IC17.1(A:OUT) J24.3 R80.2
SLAVE_BMOT_VREF_N: R82.1 ; also sheet 3
SLAVE_BMOT_VREF_P: R83.1 ; also sheet 3
VOFF_2V: IC17.6(B:-IN) IC17.7(B:OUT) R76.1 R77.1 R84.1
Unconnected: J22.4 J23.4 J24.4

### Notes on the sheet
- Brushless motors

## Sheet 9 of 9
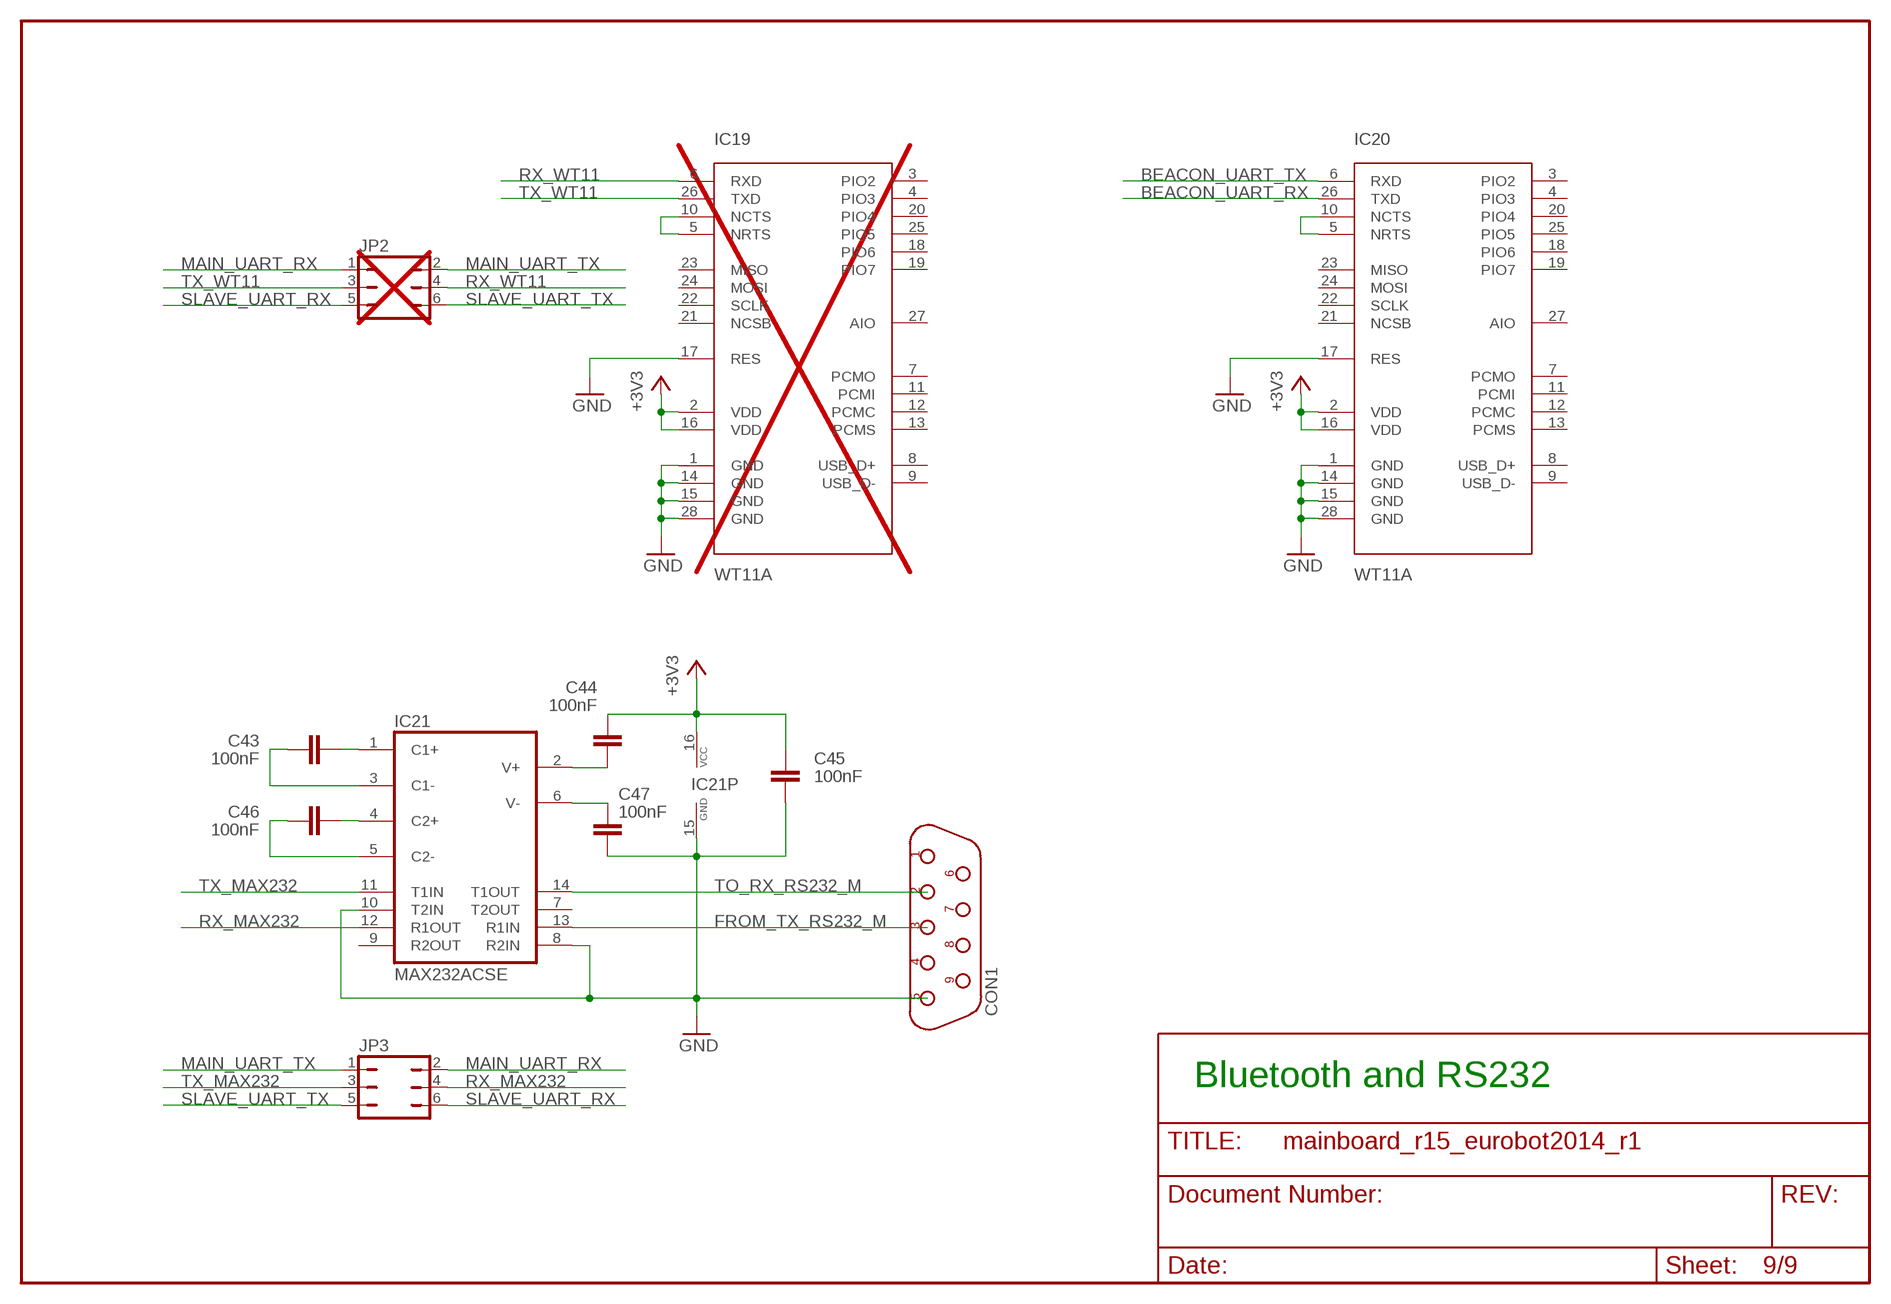
[diagram p8: schematic, sheet 9]

### Parts
C43  100nF  C-EUC0603  [C0603]
C44  100nF  C-EUC0603  [C0603]
C45  100nF  C-EUC0603  [C0603]
C46  100nF  C-EUC0603  [C0603]
C47  100nF  C-EUC0603  [C0603]
CON1  DB9F/90  [D-09F/90]
IC19  WT11A  [WT11]
IC20  WT11A  [WT11]
IC21  MAX232ACSE  [SO16]
JP2  JP3Q  [JP3Q]
JP3  JP3Q  [JP3Q]

### Nets
+3V3: C44.2 C45.2 IC19.2(VDD) IC19.16(VDD) IC20.2(VDD) IC20.16(VDD) IC21.16(VCC) ; also sheet 1,2,3
BEACON_UART_RX: IC20.26(TXD) ; also sheet 2
BEACON_UART_TX: IC20.6(RXD) ; also sheet 2
FROM_TX_RS232_M: CON1.3 IC21.13(R1IN)
GND: C45.1 C47.1 CON1.5 IC19.1(GND) IC19.14(GND) IC19.15(GND) IC19.17(RES) IC19.28(GND) IC20.1(GND) IC20.14(GND) IC20.15(GND) IC20.17(RES) IC20.28(GND) IC21.8(R2IN) IC21.10(T2IN) IC21.15(GND) ; also sheet 1,2,3,5,8
MAIN_UART_RX: JP2.1 JP3.2 ; also sheet 2
MAIN_UART_TX: JP2.2 JP3.1 ; also sheet 2
N$16: IC20.5(NRTS) IC20.10(NCTS)
N$27: C43.2 IC21.1(C1+)
N$30: C43.1 IC21.3(C1-)
N$31: C46.2 IC21.4(C2+)
N$32: C46.1 IC21.5(C2-)
N$33: C44.1 IC21.2(V+)
N$34: C47.2 IC21.6(V-)
N$93: IC19.5(NRTS) IC19.10(NCTS)
RX_MAX232: IC21.12(R1OUT) JP3.4
RX_WT11: IC19.6(RXD) JP2.4
SLAVE_UART_RX: JP2.5 JP3.6 ; also sheet 3
SLAVE_UART_TX: JP2.6 JP3.5 ; also sheet 3
TO_RX_RS232_M: CON1.2 IC21.14(T1OUT)
TX_MAX232: IC21.11(T1IN) JP3.3
TX_WT11: IC19.26(TXD) JP2.3
Unconnected: CON1.1 CON1.4 CON1.6 CON1.7 CON1.8 CON1.9 IC19.3(PIO2) IC19.4(PIO3) IC19.7(PCMO) IC19.8(USB_D+) IC19.9(USB_D-) IC19.11(PCMI) IC19.12(PCMC) IC19.13(PCMS) IC19.18(PIO6) IC19.19(PIO7) IC19.20(PIO4) IC19.21(NCSB) IC19.22(SCLK) IC19.23(MISO) IC19.24(MOSI) IC19.25(PIO5) IC19.27(AIO) IC20.3(PIO2) IC20.4(PIO3) IC20.7(PCMO) IC20.8(USB_D+) IC20.9(USB_D-) IC20.11(PCMI) IC20.12(PCMC) IC20.13(PCMS) IC20.18(PIO6) IC20.19(PIO7) IC20.20(PIO4) IC20.21(NCSB) IC20.22(SCLK) IC20.23(MISO) IC20.24(MOSI) IC20.25(PIO5) IC20.27(AIO) IC21.7(T2OUT) IC21.9(R2OUT)

### Notes on the sheet
- Bluetooth and RS232

## Library data of the parts
C1 C4-C7 C9 C11 C13 C14 C16-C20 C22-C47 = rcl:C-EU: CAPACITOR, European symbol
C2 C3 C8 C10 C12 C15 C21 = rcl:CPOL-US: POLARIZED CAPACITOR, American symbol
CN1 = con-hdrs40:HDR-1X5: HEADER CONNECTOR
CON1 = connect:DB9F/90
D1 D2 = ipc-7351-diode:SCHOTTKY_
F1 F2 = fuse:FUSE: Fuse
IC1 IC3 = v-reg:LM317TS: VOLTAGE REGULATOR
IC2 = eagle_jbs_lib:ADR443
IC4 IC5 = eagle_jbs_lib:DSPIC33FJXXMC804
IC6 IC14 IC17 = linear:OPA2*: Dual Operational Amplifier Low Power, Single-Supply, Rail-To-Rail Operational Amplifier Source: http://focus.ti.com/lit/ds/symlink/opa2345.pdf
IC7 IC10 IC11 = eagle_jbs_lib:TC4427
IC8 IC9 IC12 IC13 = eagle_jbs_lib:IRF7389
IC15 IC16 IC18 = eagle_jbs_lib:ADS713
IC19 IC20 = eagle_jbs_lib:WT11
IC21 = maxim-10:MAX232*: RS232 TRANSEIVER
J1 J6-J11 J15-J21 = con-molex:22-?-03: CONNECTOR wire to board 2.54 mm (.1 inch) pitch header
J2 J4 = con-molex:22-?-05: CONNECTOR wire to board 2.54 mm (.1 inch) pitch header
J3 J5 = con-molex:22-?-02: CONNECTOR wire to board 2.54 mm (.1 inch) pitch header
J12-J14 J22-J24 = con-molex:22-?-04: CONNECTOR wire to board 2.54 mm (.1 inch) pitch header
JP1 = jumper:JP2E: JUMPER
JP2 JP3 = jumper:JP3Q: JUMPER
K1 = relay:G5LE: RELAY 1 x switch, 10 A/120 V AC, 8 A/30 V DC, Omron
LED1-LED10 = led:LED: LED OSRAM: - CHIPLED LG R971, LG N971, LY N971, LG Q971, LY Q971, LO R971, LY R971 LH N974, LH R974 LS Q976, LO Q976, LY Q976 LO Q996 - Hyper CHIPLED LW Q18S LB Q993, LB Q99A, LB R99A - SideLED LS A670, LO A670, LY A670, LG A670, LP A670 LB A673, LV A673, LT A673, LW A673 LH A674 LY A675 LS A676, LA A676, LO A676, LY A676, LW A676 LS A679, LY A679, LG A679 - Hyper Micro SIDELED® LS Y876, LA Y876, LO Y876, LY Y876 LT Y87S - SmartLED LW L88C, LW L88S LB L89C, LB L89S, LG L890 LS L89K, LO L89K, LY L89K LS L896, LA L896, LO L896, LY L896 - TOPLED LS T670, LO T670, LY T670, LG T670, LP T670 LSG T670, LSP T670, LSY T670, LOP T670, LYG T670 LG T671, LOG T671, LSG T671 LB T673, LV T673, LT T673, LW T673 LH T674 LS T676, LA T676, LO T676, LY T676, LB T676, LH T676, LSB T676, LW T676 LB T67C, LV T67C, LT T67C, LS T67K, LO T67K, LY T67K, LW E67C LS E67B, LA E67B, LO E67B, LY E67B, LB E67C, LV E67C, LT E67C LW T67C LS T679, LY T679, LG T679 LS T770, LO T770, LY T770, LG T770, LP T770 LB T773, LV T773, LT T773, LW T773 LH T774 LS E675, LA E675, LY E675, LS T675 LS T776, LA T776, LO T776, LY T776, LB T776 LHGB T686 LT T68C, LB T68C - Hyper Mini TOPLED® LB M676 - Mini TOPLED Santana® LG M470 LS M47K, LO M47K, LY M47K Source: http://www.osram.convergy.de - LUMILED® LXK2-PW12-R00, LXK2-PW12-S00, LXK2-PW14-U00, LXK2-PW14-V00 LXK2-PM12-R00, LXK2-PM12-S00, LXK2-PM14-U00 LXK2-PE12-Q00, LXK2-PE12-R00, LXK2-PE12-S00, LXK2-PE14-T00, LXK2-PE14-U00 LXK2-PB12-K00, LXK2-PB12-L00, LXK2-PB12-M00, LXK2-PB14-N00, LXK2-PB14-P00, LXK2-PB14-Q00 LXK2-PR12-L00, LXK2-PR12-M00, LXK2-PR14-Q00, LXK2-PR14-R00 LXK2-PD12-Q00, LXK2-PD12-R00, LXK2-PD12-S00 LXK2-PH12-R00, LXK2-PH12-S00 LXK2-PL12-P00, LXK2-PL12-Q00, LXK2-PL12-R00 Source: www.luxeon.com
Q1 Q2 = crystal:CRYSTAL: CRYSTAL
R1-R77 R79-R85 = rcl:R-US_: RESISTOR, American symbol
S1 = switch-omron:10-XX: OMRON SWITCH
SV1 = con-harting-ml:ML10: HARTING
X1-X11 = con-wago-508:W237-02P: WAGO SREW CLAMP